# EAGLE design fountainPCB_v3 (EAGLE 9.6.2)

## Sheet 1 of 2
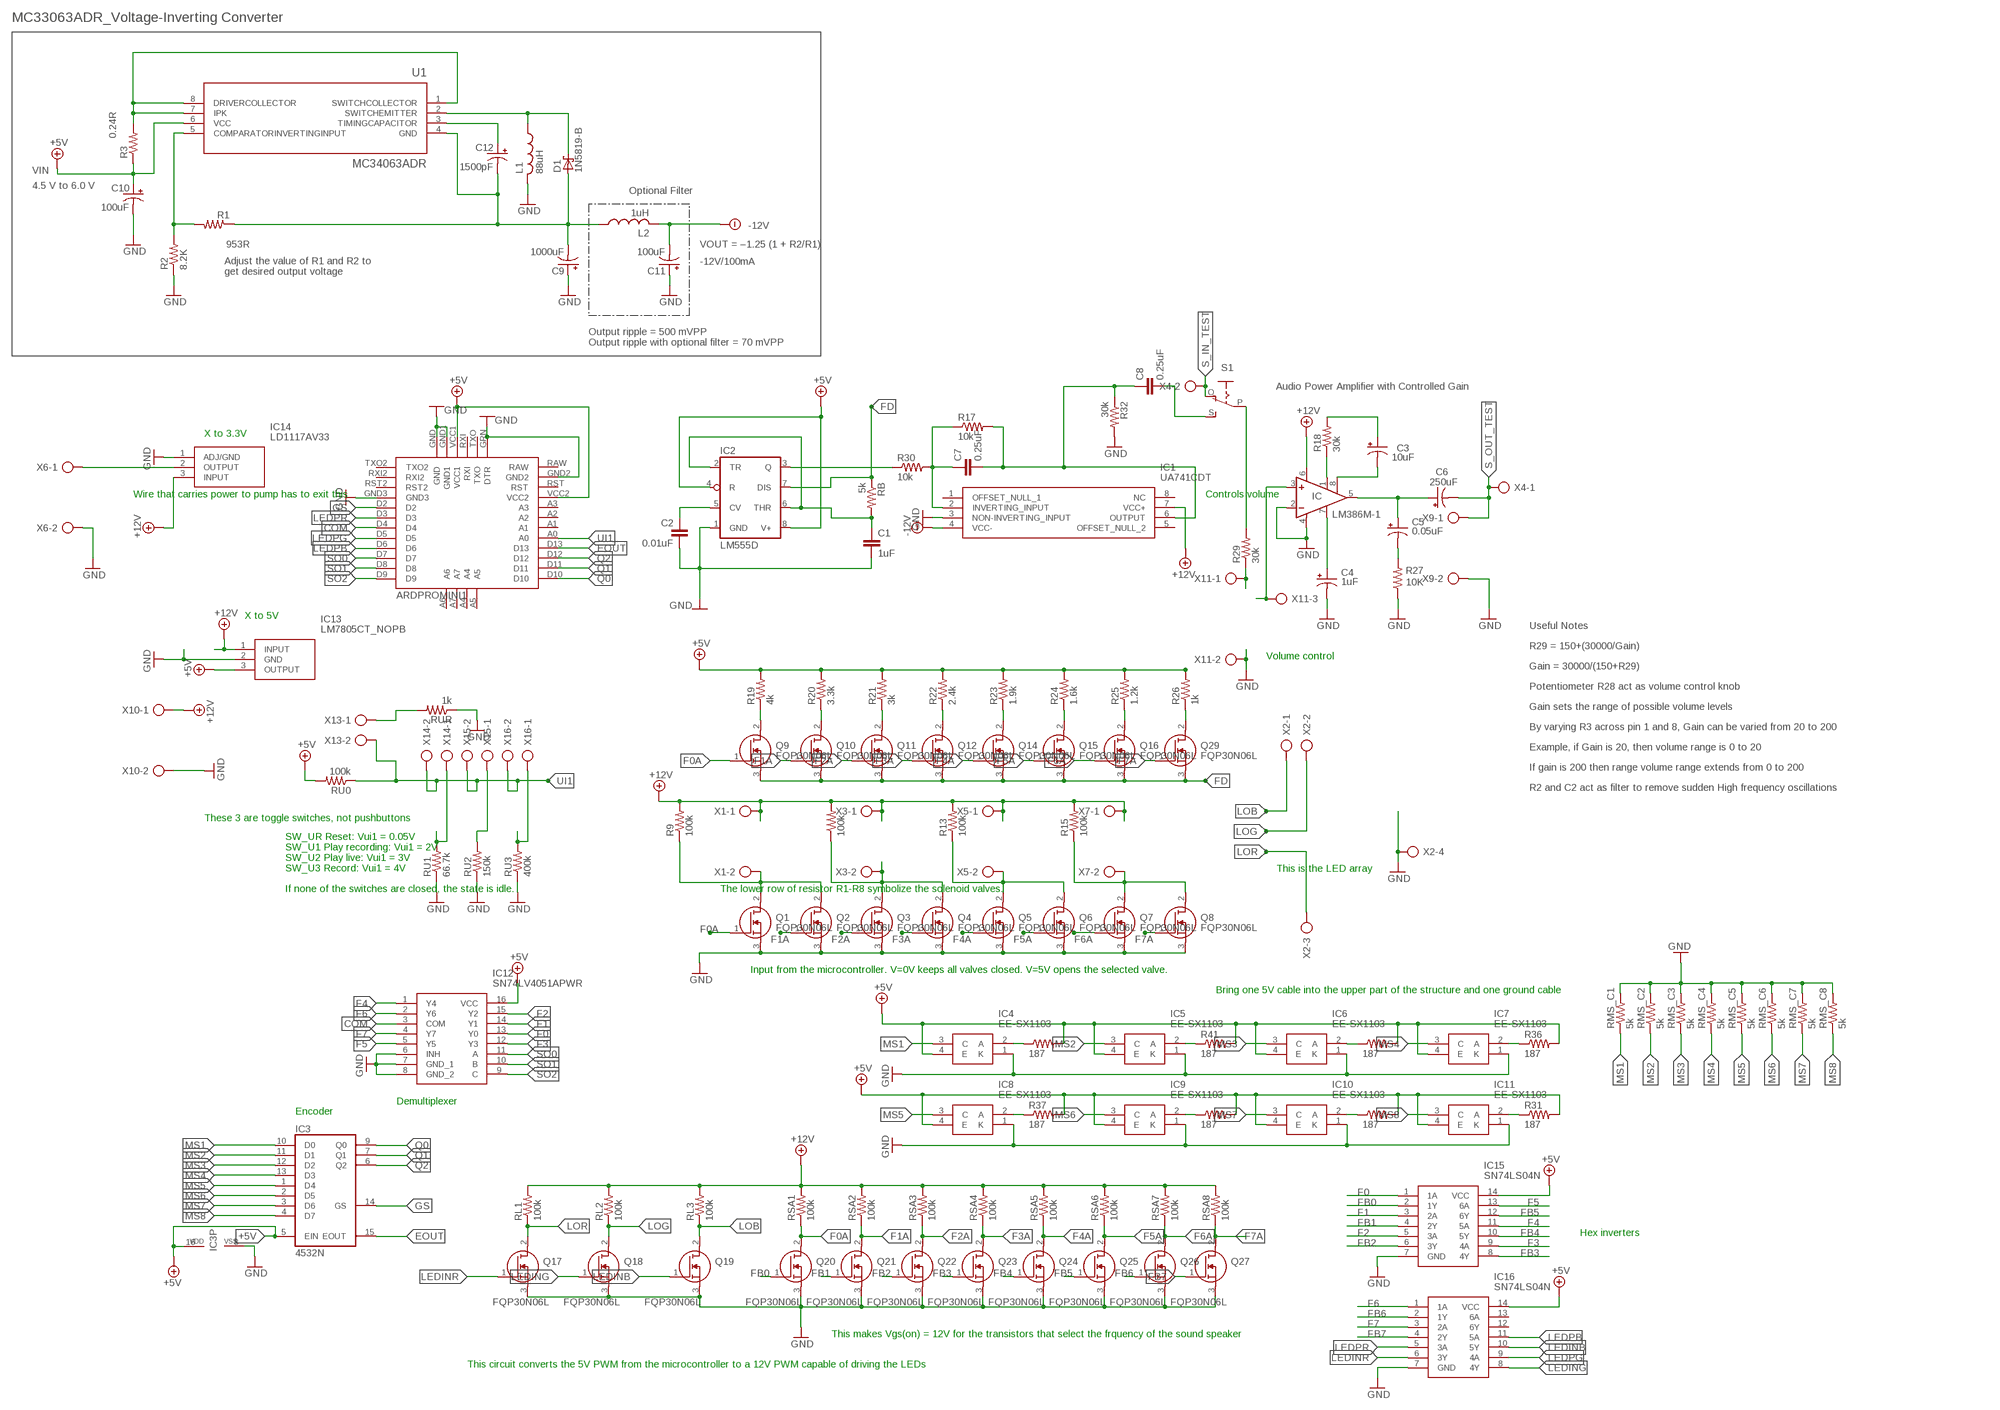
[diagram p0: schematic, sheet 1]

### Parts
ARDPROMINI1  ARDUINOPROMINI  [ARDUINOPROMINI]
C1  1uF  C-EUC0805  [C0805]
C2  0.01uF  C-EUC0805  [C0805]
C3  10uF  CPOL-US085CS-1AR  [085CS_1AR]
C4  1uF  CPOL-US085CS-1AR  [085CS_1AR]
C5  0.05uF  CPOL-US085CS-1AR  [085CS_1AR]
C6  250uF  CPOL-US085CS-1AR  [085CS_1AR]
C7  0.25uF  C-EUC0805  [C0805]
C8  0.25uF  C-EUC0805  [C0805]
C9  1000uF  CPOL-USE7.5-16  [E7,5-16]
C10  100uF  CPOL-USE2,5-6E  [E2,5-6E]
C11  100uF  CPOL-USE2,5-6E  [E2,5-6E]
C12  1500pF  CPOL-USE2,5-6E  [E2,5-6E]
D1  1N5819-B  [DO41-7.6]
IC  LM386M-1  [SO08]
IC1  UA741CDT  [SOIC127P600X175-8N]
IC2  LM555D  [SO08]
IC3  4532N  [DIL16]
IC4  EE-SX1103  [EESX1103]
IC5  EE-SX1103  [EESX1103]
IC6  EE-SX1103  [EESX1103]
IC7  EE-SX1103  [EESX1103]
IC8  EE-SX1103  [EESX1103]
IC9  EE-SX1103  [EESX1103]
IC10  EE-SX1103  [EESX1103]
IC11  EE-SX1103  [EESX1103]
IC12  SN74LV4051APWR  [SOP65P640X120-16N]
IC13  LM7805CT_NOPB  [TO254P470X1028X1955-3P]
IC14  LD1117AV33  [TO255P460X1020X2008-3P]
IC15  SN74LS04N  [DIP794W53P254L1930H508Q14N]
IC16  SN74LS04N  [DIP794W53P254L1930H508Q14N]
L1  88uH  L-USL3216C  [L3216C]
L2  1uH  L-USL3216C  [L3216C]
Q1  FQP30N06L  [TO254P470X1016X2019-3P]
Q2  FQP30N06L  [TO254P470X1016X2019-3P]
Q3  FQP30N06L  [TO254P470X1016X2019-3P]
Q4  FQP30N06L  [TO254P470X1016X2019-3P]
Q5  FQP30N06L  [TO254P470X1016X2019-3P]
Q6  FQP30N06L  [TO254P470X1016X2019-3P]
Q7  FQP30N06L  [TO254P470X1016X2019-3P]
Q8  FQP30N06L  [TO254P470X1016X2019-3P]
Q9  FQP30N06L  [TO254P470X1016X2019-3P]
Q10  FQP30N06L  [TO254P470X1016X2019-3P]
Q11  FQP30N06L  [TO254P470X1016X2019-3P]
Q12  FQP30N06L  [TO254P470X1016X2019-3P]
Q14  FQP30N06L  [TO254P470X1016X2019-3P]
Q15  FQP30N06L  [TO254P470X1016X2019-3P]
Q16  FQP30N06L  [TO254P470X1016X2019-3P]
Q17  FQP30N06L  [TO254P470X1016X2019-3P]
Q18  FQP30N06L  [TO254P470X1016X2019-3P]
Q19  FQP30N06L  [TO254P470X1016X2019-3P]
Q20  FQP30N06L  [TO254P470X1016X2019-3P]
Q21  FQP30N06L  [TO254P470X1016X2019-3P]
Q22  FQP30N06L  [TO254P470X1016X2019-3P]
Q23  FQP30N06L  [TO254P470X1016X2019-3P]
Q24  FQP30N06L  [TO254P470X1016X2019-3P]
Q25  FQP30N06L  [TO254P470X1016X2019-3P]
Q26  FQP30N06L  [TO254P470X1016X2019-3P]
Q27  FQP30N06L  [TO254P470X1016X2019-3P]
Q29  FQP30N06L  [TO254P470X1016X2019-3P]
R1  953R  R-US_M0805  [M0805]
R2  8.2K  R-US_M0805  [M0805]
R3  0.24R  R-US_M0805  [M0805]
R9  100k  R-US_R0805  [R0805]
R11  100k  R-US_R0805  [R0805]
R13  100k  R-US_R0805  [R0805]
R15  100k  R-US_R0805  [R0805]
R17  10k  R-US_R0805  [R0805]
R18  30k  R-US_R0805  [R0805]
R19  4k  R-US_R0805  [R0805]
R20  3.3k  R-US_R0805  [R0805]
R21  3k  R-US_R0805  [R0805]
R22  2.4k  R-US_R0805  [R0805]
R23  1.9k  R-US_R0805  [R0805]
R24  1.6k  R-US_R0805  [R0805]
R25  1.2k  R-US_R0805  [R0805]
R26  1k  R-US_R0805  [R0805]
R27  10K  R-US_M0805  [M0805]
R29  30k  R-US_R0805  [R0805]
R30  10k  R-US_R0805  [R0805]
R31  187  R-US_R0805  [R0805]
R32  30k  R-US_R0805  [R0805]
R34  187  R-US_R0805  [R0805]
R36  187  R-US_R0805  [R0805]
R37  187  R-US_R0805  [R0805]
R40  187  R-US_R0805  [R0805]
R41  187  R-US_R0805  [R0805]
R42  187  R-US_R0805  [R0805]
R44  187  R-US_R0805  [R0805]
RB  5k  R-US_R0805  [R0805]
RL1  100k  R-US_R0805  [R0805]
RL2  100k  R-US_R0805  [R0805]
RL3  100k  R-US_R0805  [R0805]
RMS_C1  5k  R-US_R0805  [R0805]
RMS_C2  5k  R-US_R0805  [R0805]
RMS_C3  5k  R-US_R0805  [R0805]
RMS_C4  5k  R-US_R0805  [R0805]
RMS_C5  5k  R-US_R0805  [R0805]
RMS_C6  5k  R-US_R0805  [R0805]
RMS_C7  5k  R-US_R0805  [R0805]
RMS_C8  5k  R-US_R0805  [R0805]
RSA1  100k  R-US_R0805  [R0805]
RSA2  100k  R-US_R0805  [R0805]
RSA3  100k  R-US_R0805  [R0805]
RSA4  100k  R-US_R0805  [R0805]
RSA5  100k  R-US_R0805  [R0805]
RSA6  100k  R-US_R0805  [R0805]
RSA7  100k  R-US_R0805  [R0805]
RSA8  100k  R-US_R0805  [R0805]
RU0  100k  R-US_R0805  [R0805]
RU1  66.7k  R-US_R0805  [R0805]
RU2  150k  R-US_R0805  [R0805]
RU3  400k  R-US_R0805  [R0805]
RUR  1k  R-US_R0805  [R0805]
S1  EG1218S  [EG1218]
U1  MC34063ADR  [D8]
X1  AK300/2  [AK300/2]
X2  AK300/4  [AK300/4]
X3  AK300/2  [AK300/2]
X4  AK300/2  [AK300/2]
X5  AK300/2  [AK300/2]
X6  AK300/2  [AK300/2]
X7  AK300/2  [AK300/2]
X9  AK300/2  [AK300/2]
X10  AK300/2  [AK300/2]
X11  AK300/3  [AK300/3]
X13  AK300/2  [AK300/2]
X14  AK300/2  [AK300/2]
X15  AK300/2  [AK300/2]
X16  AK300/2  [AK300/2]

### Nets
+5V: ARDPROMINI1.VCC1 ARDPROMINI1.VCC2 C10.+ IC2.4(R) IC2.8(V+) IC3.5(EIN) IC3.16(VDD) IC4.4(E) IC5.4(E) IC6.4(E) IC7.4(E) IC8.4(E) IC9.4(E) IC10.4(E) IC11.4(E) IC12.16(VCC) IC13.3(OUTPUT) IC15.14(VCC) IC16.14(VCC) R3.1 R19.2 R20.2 R21.2 R22.2 R23.2 R24.2 R25.2 R26.2 R31.2 R34.2 R36.2 R37.2 R40.2 R41.2 R42.2 R44.2 RU0.2 U1.6(VCC)
+12V: IC1.7(VCC+) IC13.1(INPUT) IC14.3(INPUT) IC.6(VS) R9.2 R11.2 R13.2 R15.2 RL1.2 RL2.2 RL3.2 RSA1.2 RSA2.2 RSA3.2 RSA4.2 RSA5.2 RSA6.2 RSA7.2 RSA8.2 X1.1 X3.1 X5.1 X7.1 X10.1
+12V1: IC14.2(OUTPUT) X6.1
-12V: C11.- IC1.4(VCC-) L2.2
COM: ARDPROMINI1.D4 IC12.3(COM)
EOUT: ARDPROMINI1.D13 IC3.15(EOUT)
F0: IC12.13(Y0) IC15.1(1A)
F0A: Q1.1(G) Q9.1(G) Q20.2(D) RSA1.1
F1: IC12.14(Y1) IC15.3(2A)
F1A: Q2.1(G) Q10.1(G) Q21.2(D) RSA2.1
F2: IC12.15(Y2) IC15.5(3A)
F2A: Q3.1(G) Q11.1(G) Q22.2(D) RSA3.1
F3: IC12.12(Y3) IC15.9(4A)
F3A: Q4.1(G) Q12.1(G) Q23.2(D) RSA4.1
F4: IC12.1(Y4) IC15.11(5A)
F4A: Q5.1(G) Q14.1(G) Q24.2(D) RSA5.1
F5: IC12.5(Y5) IC15.13(6A)
F5A: Q6.1(G) Q15.1(G) Q25.2(D) RSA6.1
F6: IC12.2(Y6) IC16.1(1A)
F6A: Q7.1(G) Q16.1(G) Q26.2(D) RSA7.1
F7: IC12.4(Y7) IC16.3(2A)
F7A: Q8.1(G) Q27.2(D) Q29.1(G) RSA8.1
FB0: IC15.2(1Y) Q20.1(G)
FB1: IC15.4(2Y) Q21.1(G)
FB2: IC15.6(3Y) Q22.1(G)
FB3: IC15.8(4Y) Q23.1(G)
FB4: IC15.10(5Y) Q24.1(G)
FB5: IC15.12(6Y) Q25.1(G)
FB6: IC16.2(1Y) Q26.1(G)
FB7: IC16.4(2Y) Q27.1(G)
FD: IC2.7(DIS) Q9.3(S) Q10.3(S) Q11.3(S) Q12.3(S) Q14.3(S) Q15.3(S) Q16.3(S) Q29.3(S) RB.1
GND: ARDPROMINI1.GND ARDPROMINI1.GND1 ARDPROMINI1.GND2 ARDPROMINI1.GND3 ARDPROMINI1.GRN(DTR) C1.2 C2.2 C4.- C9.+ C10.- C11.+ IC1.3(NON-INVERTING_INPUT) IC2.1(GND) IC3.8(VSS) IC4.1(K) IC5.1(K) IC6.1(K) IC7.1(K) IC8.1(K) IC9.1(K) IC10.1(K) IC11.1(K) IC12.6(INH) IC12.7(GND_1) IC12.8(GND_2) IC13.2(GND) IC14.1(ADJ/GND) IC15.7(GND) IC16.7(GND) IC.2(-IN) IC.4(GND) L1.2 Q1.3(S) Q2.3(S) Q3.3(S) Q4.3(S) Q5.3(S) Q6.3(S) Q7.3(S) Q8.3(S) Q17.3(S) Q18.3(S) Q19.3(S) Q20.3(S) Q21.3(S) Q22.3(S) Q23.3(S) Q24.3(S) Q25.3(S) Q26.3(S) Q27.3(S) R2.1 R27.1 R32.2 RMS_C1.2 RMS_C2.2 RMS_C3.2 RMS_C4.2 RMS_C5.2 RMS_C6.2 RMS_C7.2 RMS_C8.2 RU1.1 RU2.1 RU3.1 RUR.1 X2.4 X6.2 X9.2 X10.2 X11.2
GS: ARDPROMINI1.D2 IC3.14(GS)
LEDINB: IC16.10(5Y) Q19.1(G)
LEDING: IC16.8(4Y) Q18.1(G)
LEDINR: IC16.6(3Y) Q17.1(G)
LEDPB: ARDPROMINI1.D6 IC16.11(5A)
LEDPG: ARDPROMINI1.D5 IC16.9(4A)
LEDPR: ARDPROMINI1.D3 IC16.5(3A)
LOB: Q19.2(D) RL3.1 X2.1
LOG: Q18.2(D) RL2.1 X2.2
LOR: Q17.2(D) RL1.1 X2.3
MS1: IC3.10(D0) IC4.3(C) RMS_C1.1
MS2: IC3.11(D1) IC5.3(C) RMS_C2.1
MS3: IC3.12(D2) IC6.3(C) RMS_C3.1
MS4: IC3.13(D3) IC7.3(C) RMS_C4.1
MS5: IC3.1(D4) IC8.3(C) RMS_C5.1
MS6: IC3.2(D5) IC9.3(C) RMS_C6.1
MS7: IC3.3(D6) IC10.3(C) RMS_C7.1
MS8: IC3.4(D7) IC11.3(C) RMS_C8.1
N$1: Q1.2(D) Q2.2(D) R9.1 X1.2
N$3: Q3.2(D) Q4.2(D) R11.1 X3.2
N$4: R3.2 U1.1(SWITCHCOLLECTOR) U1.7(IPK) U1.8(DRIVERCOLLECTOR)
N$5: Q5.2(D) Q6.2(D) R13.1 X5.2
N$6: D1.C L1.1 U1.2(SWITCHEMITTER)
N$7: Q7.2(D) Q8.2(D) R15.1 X7.2
N$8: C12.+ U1.3(TIMINGCAPACITOR)
N$9: C2.1 IC2.5(CV)
N$10: IC4.2(A) R44.1
N$11: C1.1 IC2.2(TR) IC2.6(THR) RB.2
N$12: Q9.2(D) R19.1
N$13: Q10.2(D) R20.1
N$14: Q11.2(D) R21.1
N$15: Q12.2(D) R22.1
N$16: Q14.2(D) R23.1
N$17: Q15.2(D) R24.1
N$18: Q16.2(D) R25.1
N$19: Q29.2(D) R26.1
N$20: C4.+ IC.7(BYPASS)
N$21: C5.+ C6.+ IC.5(OUT)
N$22: C3.- IC.8(GAIN)
N$23: IC.3(+IN) X11.3
N$24: C5.- R27.2
N$25: IC.1(GAIN) R18.1
N$26: C3.+ R18.2
N$27: R29.2 S1.P
N$28: C7.1 IC1.2(INVERTING_INPUT) R17.1 R30.2
N$29: C7.2 C8.1 IC1.6(OUTPUT) R17.2 R32.1
N$30: RUR.2 X13.1
N$31: IC8.2(A) R37.1
N$32: IC5.2(A) R41.1
N$33: RU3.2 X16.1
N$34: RU2.2 X15.1
N$35: RU1.2 X14.1
N$36: IC6.2(A) R42.1
N$37: IC7.2(A) R36.1
N$38: R1.2 R2.2 U1.5(COMPARATORINVERTINGINPUT)
N$39: IC11.2(A) R31.1
N$40: IC10.2(A) R40.1
N$41: IC9.2(A) R34.1
N$42: C9.- C12.- D1.A L2.1 R1.1 U1.4(GND)
N$43: R29.1 X11.1
N$44: C8.2 S1.S
N$45: IC2.3(Q) R30.1
Q0: ARDPROMINI1.D10 IC3.9(Q0)
Q1: ARDPROMINI1.D11 IC3.7(Q1)
Q2: ARDPROMINI1.D12 IC3.6(Q2)
S_IN_TEST: S1.O X4.2
S_OUT_TEST: C6.- X4.1 X9.1
SO0: ARDPROMINI1.D7 IC12.11(A)
SO1: ARDPROMINI1.D8 IC12.10(B)
SO2: ARDPROMINI1.D9 IC12.9(C)
UI1: ARDPROMINI1.A0 RU0.1 X13.2 X14.2 X15.2 X16.2
Unconnected: ARDPROMINI1.A1 ARDPROMINI1.A2 ARDPROMINI1.A3 ARDPROMINI1.A4 ARDPROMINI1.A5 ARDPROMINI1.A6 ARDPROMINI1.A7 ARDPROMINI1.RAW ARDPROMINI1.RST ARDPROMINI1.RST2 ARDPROMINI1.RXI ARDPROMINI1.RXI2 ARDPROMINI1.TXO ARDPROMINI1.TXO2 IC1.1(OFFSET_NULL_1) IC1.5(OFFSET_NULL_2) IC1.8(NC) IC16.12(6Y) IC16.13(6A)

### Notes on the sheet
- MC33063ADR_Voltage-Inverting Converter
- VIN
- 4.5 V to 6.0 V
- Optional Filter
- VOUT = –1.25 (1 + R2/R1)
- -12V/100mA
- Adjust the value of R1 and R2 to
  get desired output voltage
- Output ripple = 500 mVPP
  Output ripple with optional filter = 70 mVPP
- Audio Power Amplifier with Controlled Gain
- X to 3.3V
- Wire that carries power to pump has to exit this | Controls volume
- X to 5V
- Useful Notes
- R29 = 150+(30000/Gain)
- Volume control
- Gain = 30000/(150+R29)
- Potentiometer R28 act as volume control knob
- Gain sets the range of possible volume levels
- By varying R3 across pin 1 and 8, Gain can be varied from 20 to 200
- Example, if Gain is 20, then volume range is 0 to 20
- If gain is 200 then range volume range extends from 0 to 200
- R2 and C2 act as filter to remove sudden High frequency oscillations
- These 3 are toggle switches, not pushbuttons
- SW_UR Reset: Vui1 = 0.05V
  SW_U1 Play recording: Vui1 = 2V
  SW_U2 Play live: Vui1 = 3V
  SW_U3 Record: Vui1 = 4V
- This is the LED array
- If none of the switches are closed, the state is idle. | The lower row of resistor R1-R8 symbolize the solenoid valves.
- Input from the microcontroller. V=0V keeps all valves closed. V=5V opens the selected valve.
- Bring one 5V cable into the upper part of the structure and one ground cable
- Demultiplexer
- Encoder
- Hex inverters
- This makes Vgs(on) = 12V for the transistors that select the frquency of the sound speaker
- This circuit converts the 5V PWM from the microcontroller to a 12V PWM capable of driving the LEDs

## Sheet 2 of 2

## Library data of the parts
ARDPROMINI1 = ARDPROMINI:ARDUINOPROMINI
C1 C2 = rcl:C-EU: CAPACITOR, European symbol
C3-C6 = resistor:CPOL-US: POLARIZED CAPACITOR, American symbol; SPICEPREFIX: C
C7 C8 = rcl:C-EU: CAPACITOR, European symbol; SPICEPREFIX: C
C9-C12 = rcl:CPOL-US: POLARIZED CAPACITOR, American symbol
D1 = diode:1N581*: 1.0A SCHOTTKY BARRIER RECTIFIER Source: http://www.diodes.com/datasheets/ds23001.pdf
IC = linear:LM386?-*: Low Voltage Audio Power Amplifier Source: http://cache.national.com/ds/LM/LM386.pdf; SPICEPREFIX: X
IC1 = SamacSys_Parts:UA741CDT: UA741CDT, Operational Amplifier 1MHz, 8-Pin SO Source: Datasheet <http://www.st.com/st-web-ui/static/active/en/resource/technical/document/datasheet/CD00001252.pdf>; DESCRIPTION: UA741CDT, Operational Amplifier 1MHz, 8-Pin SO; HEIGHT: 1.75mm; MANUFACTURER_NAME: STMicroelectronics; MANUFACTURER_PART_NUMBER: UA741CDT; MOUSER_PART_NUMBER: 511-UA741CDT; MOUSER_PRICE-STOCK: https://www.mouser.co.uk/ProductDetail/STMicroelectronics/UA741CDT?qs=%2FlukYmqnbBNY05lTc81SqA%3D%3D; SPICEPREFIX: X
IC2 = linear:*555: TIMER; SPICEPREFIX: X
IC3 = 45xx:4532: 8-bit PRIORITY ENCODER; SPICEPREFIX: X
IC4-IC11 = SamacSys_Parts:EE-SX1103: Omron Photoelectric Sensor Diffuse Source: Datasheet <https://omronfs.omron.com/en_US/ecb/products/pdf/en-ee_sx1103.pdf>; DESCRIPTION: Omron Photoelectric Sensor Diffuse; HEIGHT: 5.2mm; MANUFACTURER_NAME: Omron Electronics; MANUFACTURER_PART_NUMBER: EE-SX1103; MOUSER_PART_NUMBER: 653-EE-SX1103; MOUSER_PRICE-STOCK: https://www.mouser.co.uk/ProductDetail/Omron-Electronics/EE-SX1103?qs=Pjd0UV7BHP9I6UcF70KjMA%3D%3D
IC12 = SamacSys_Parts:SN74LV4051APWR: 8-Channel Analog Multiplexer/Demultiplexer Source: Datasheet <http://www.ti.com/lit/gpn/sn74lv4051a>; DESCRIPTION: 8-Channel Analog Multiplexer/Demultiplexer; HEIGHT: 1.2mm; MANUFACTURER_NAME: Texas Instruments; MANUFACTURER_PART_NUMBER: SN74LV4051APWR; MOUSER_PART_NUMBER: 595-SN74LV4051APWR; MOUSER_PRICE-STOCK: https://www.mouser.co.uk/ProductDetail/Texas-Instruments/SN74LV4051APWR?qs=j%2FZo4ajzVJI89x2tgWsgsA%3D%3D; SPICEPREFIX: X
IC13 = SamacSys_Parts:LM7805CT_NOPB: 1.5-A, Wide VIN Fixed Voltage Regulators Source: Datasheet <http://www.ti.com/lit/gpn/lm7800>; DESCRIPTION: 1.5-A, Wide VIN Fixed Voltage Regulators; HEIGHT: 4.7mm; MANUFACTURER_NAME: Texas Instruments; MANUFACTURER_PART_NUMBER: LM7805CT/NOPB; MOUSER_PART_NUMBER: 926-LM7805CT/NOPB; MOUSER_PRICE-STOCK: https://www.mouser.co.uk/ProductDetail/Texas-Instruments/LM7805CT-NOPB?qs=OYMYEaN9QmBS2GvaX6GSkQ%3D%3D
IC14 = SamacSys_Parts:LD1117AV33: LD1117AV33, Low Dropout Voltage Regulator, 1.2A, 3.3 V +/-2%, 3-Pin TO-220 Source: Datasheet <http://www.st.com/web/en/resource/technical/document/datasheet/CD00002116.pdf>; DESCRIPTION: LD1117AV33, Low Dropout Voltage Regulator, 1.2A, 3.3 V +/-2%, 3-Pin TO-220; HEIGHT: 4.6mm; MANUFACTURER_NAME: STMicroelectronics; MANUFACTURER_PART_NUMBER: LD1117AV33; MOUSER_PART_NUMBER: 511-LD1117AV33; MOUSER_PRICE-STOCK: https://www.mouser.co.uk/ProductDetail/STMicroelectronics/LD1117AV33?qs=hUhhBvpTJN9Rfx8G8TXH1A%3D%3D
IC15 IC16 = SamacSys_Parts:SN74LS04N: Hex inverter,SN74LS04N DIP14 25pcs Source: Datasheet <http://www.ti.com/lit/gpn/sn74ls04>; DESCRIPTION: Hex inverter,SN74LS04N DIP14 25pcs; HEIGHT: 5.08mm; MANUFACTURER_NAME: Texas Instruments; MANUFACTURER_PART_NUMBER: SN74LS04N; MOUSER_PART_NUMBER: 595-SN74LS04N; MOUSER_PRICE-STOCK: https://www.mouser.co.uk/ProductDetail/Texas-Instruments/SN74LS04N?qs=spW5eSrOWB4DgGWIHPxzvg%3D%3D; SPICEPREFIX: X
L1 L2 = rcl:L-US: INDUCTOR, American symbol
Q1-Q12 Q14-Q27 Q29 = SamacSys_Parts:FQP30N06L: FQP30N06L N-Channel MOSFET, 32 A, 60 V QFET, 3-Pin TO-220 ON Semiconductor Source: Datasheet; DESCRIPTION: FQP30N06L N-Channel MOSFET, 32 A, 60 V QFET, 3-Pin TO-220 ON Semiconductor; HEIGHT: 4.7mm; MANUFACTURER_NAME: ON Semiconductor; MANUFACTURER_PART_NUMBER: FQP30N06L; MOUSER_PART_NUMBER: 512-FQP30N06L; MOUSER_PRICE-STOCK: https://www.mouser.co.uk/ProductDetail/ON-Semiconductor-Fairchild/FQP30N06L?qs=%252Beu4QTTVkDqugBwFplJ%252Bug%3D%3D
R1-R3 R9 R11 R13 R15 R17-R26 R29-R32 R34 R36 R37 R40-R42 R44 RB RL1-RL3 RMS_C1-RMS_C8 RSA1-RSA8 RU0 RU1-RU3 RUR = rcl:R-US_: RESISTOR, American symbol
R27 = resistor:R-US_: RESISTOR, American symbol; SPICEPREFIX: R
S1 = adafruit:EG1218: SLIDING SWITCH 0.1" spacing through hole, vertical SPDT slide switch http://www.ladyada.net/library/pcb/eaglelibrary.html; SPICEPREFIX: J
U1 = MC34063ADR:MC34063ADR; MANUFACTURER_PART_NUMBER: MC34063ADR; VENDOR: Texas Instruments
X1 X3 X5-X7 X9 X10 X13-X16 = con-ptr500:AK300/2: CONNECTOR; OC_FARNELL: unknown; OC_NEWARK: unknown; SPICEPREFIX: X
X2 = con-ptr500:AK300/4: CONNECTOR; OC_FARNELL: unknown; OC_NEWARK: unknown
X4 = con-ptr500:AK300/2: CONNECTOR; OC_FARNELL: unknown; OC_NEWARK: unknown
X11 = con-ptr500:AK300/3: CONNECTOR; OC_FARNELL: unknown; OC_NEWARK: unknown; SPICEPREFIX: X

## Net classes
0 default: width 0.203 mm
1 vcc: width 0.254 mm

## Board
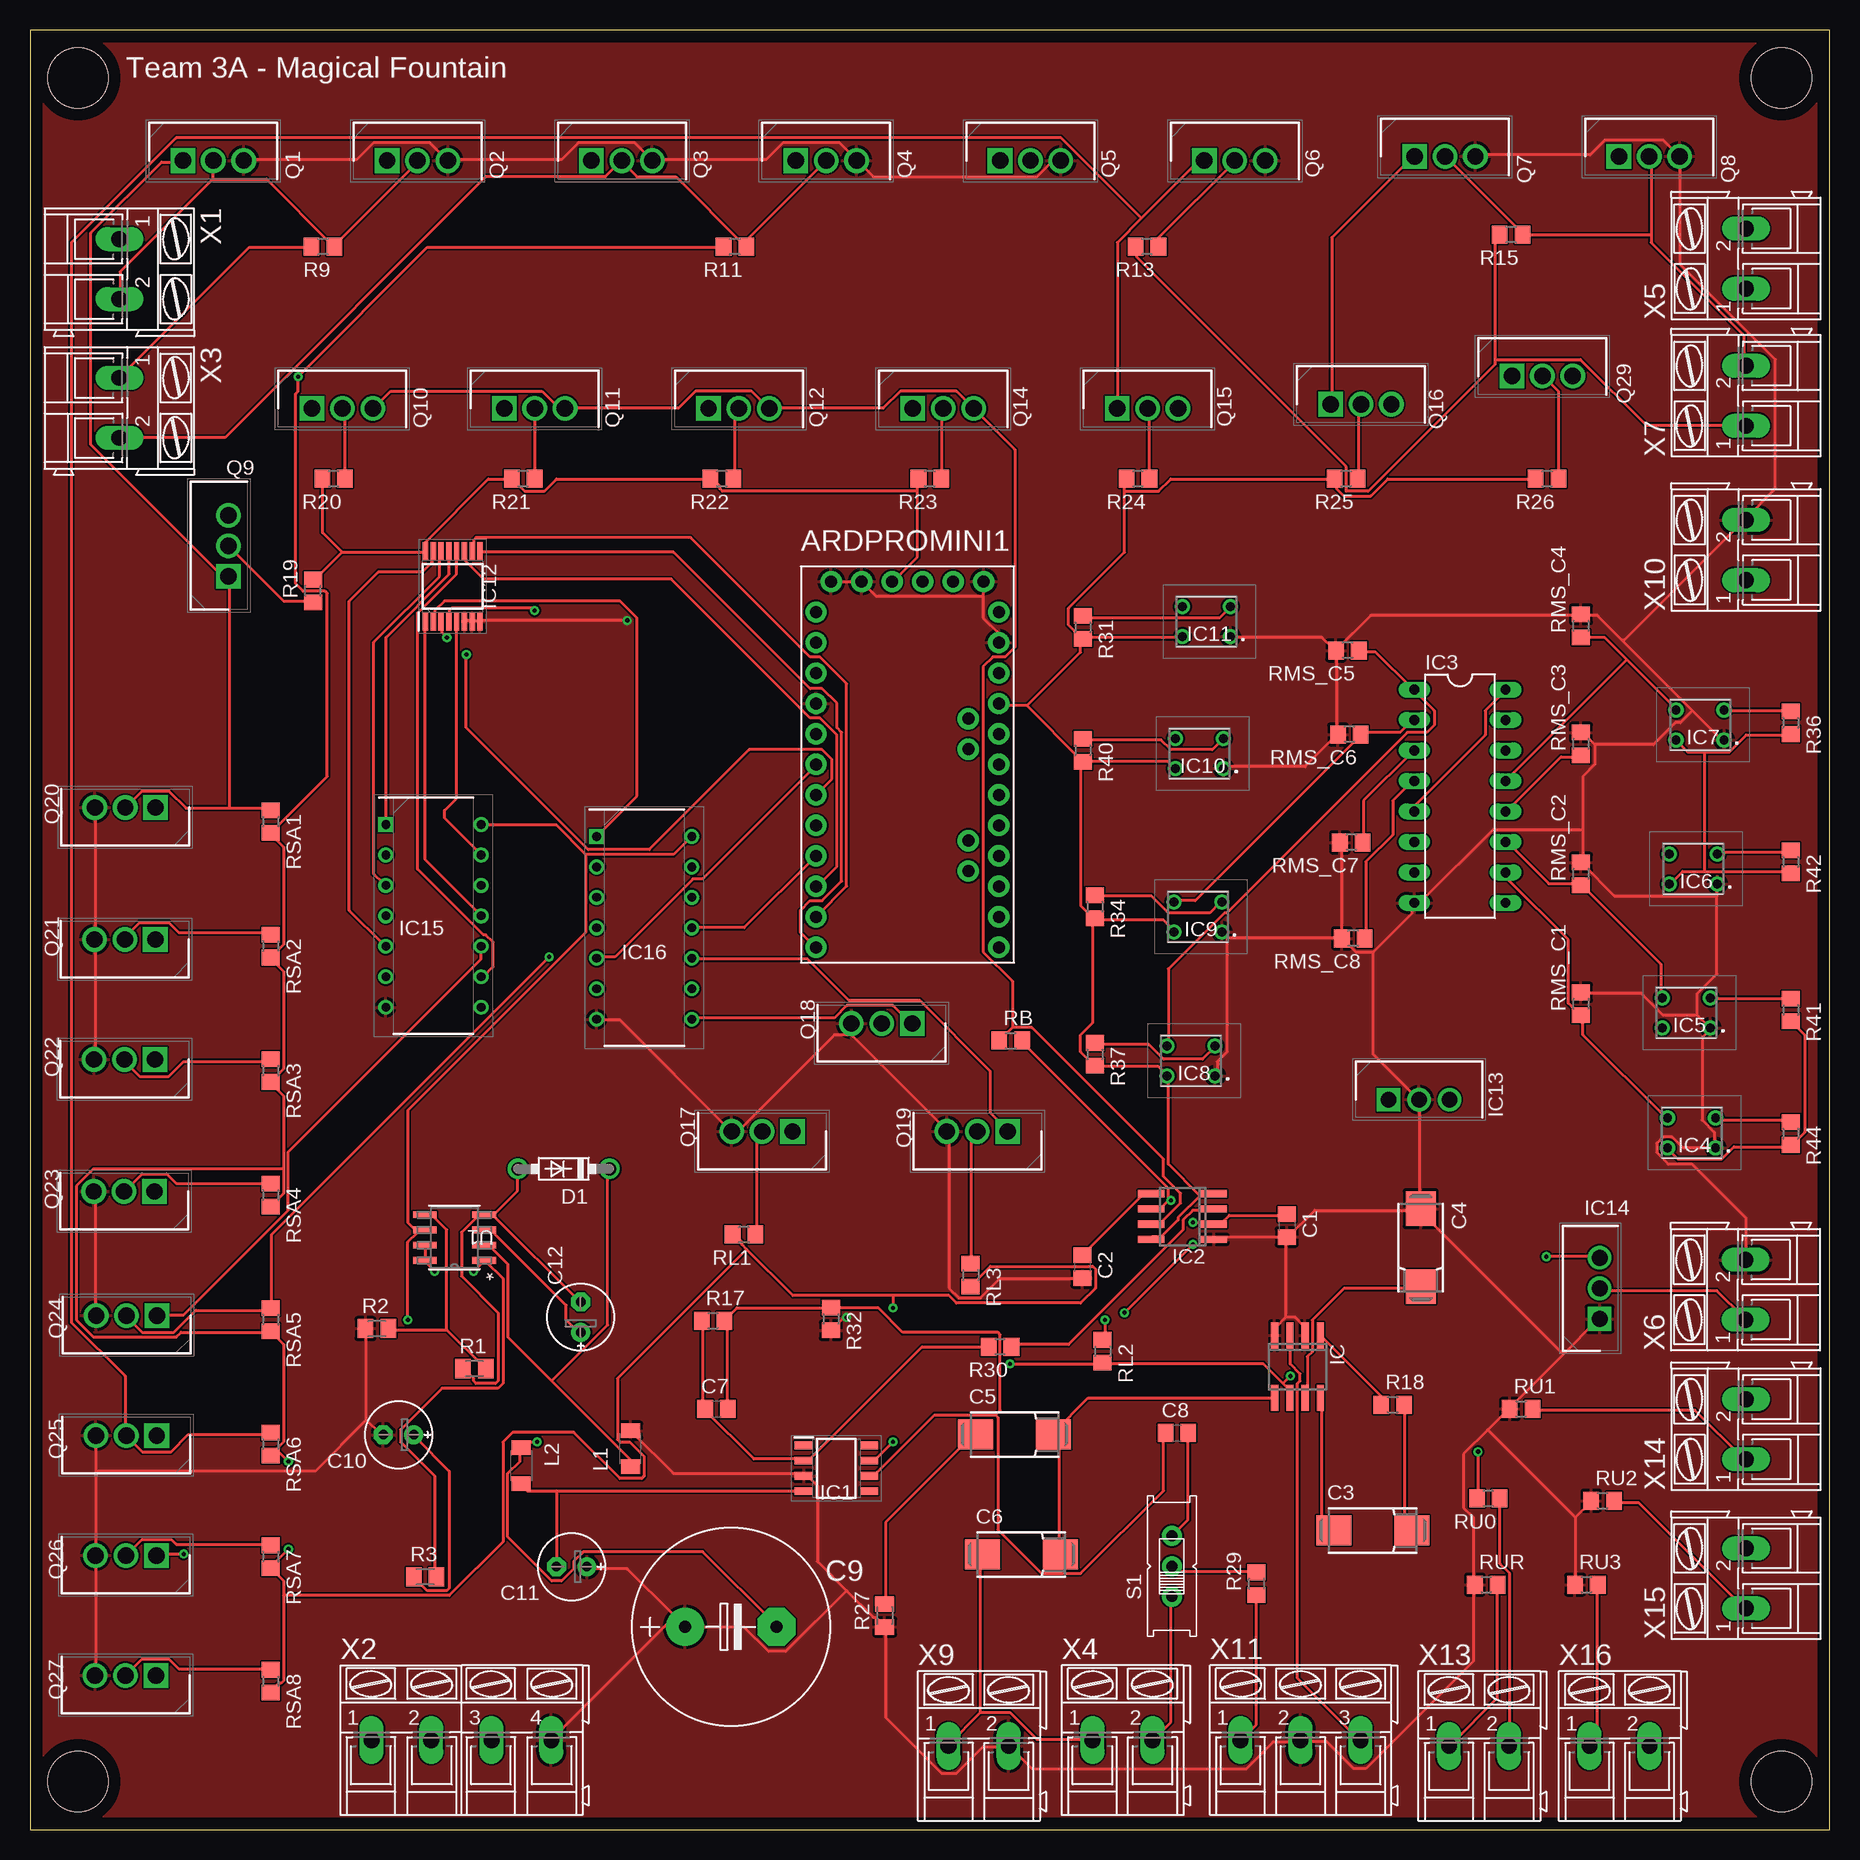
[diagram p1: board, top side]
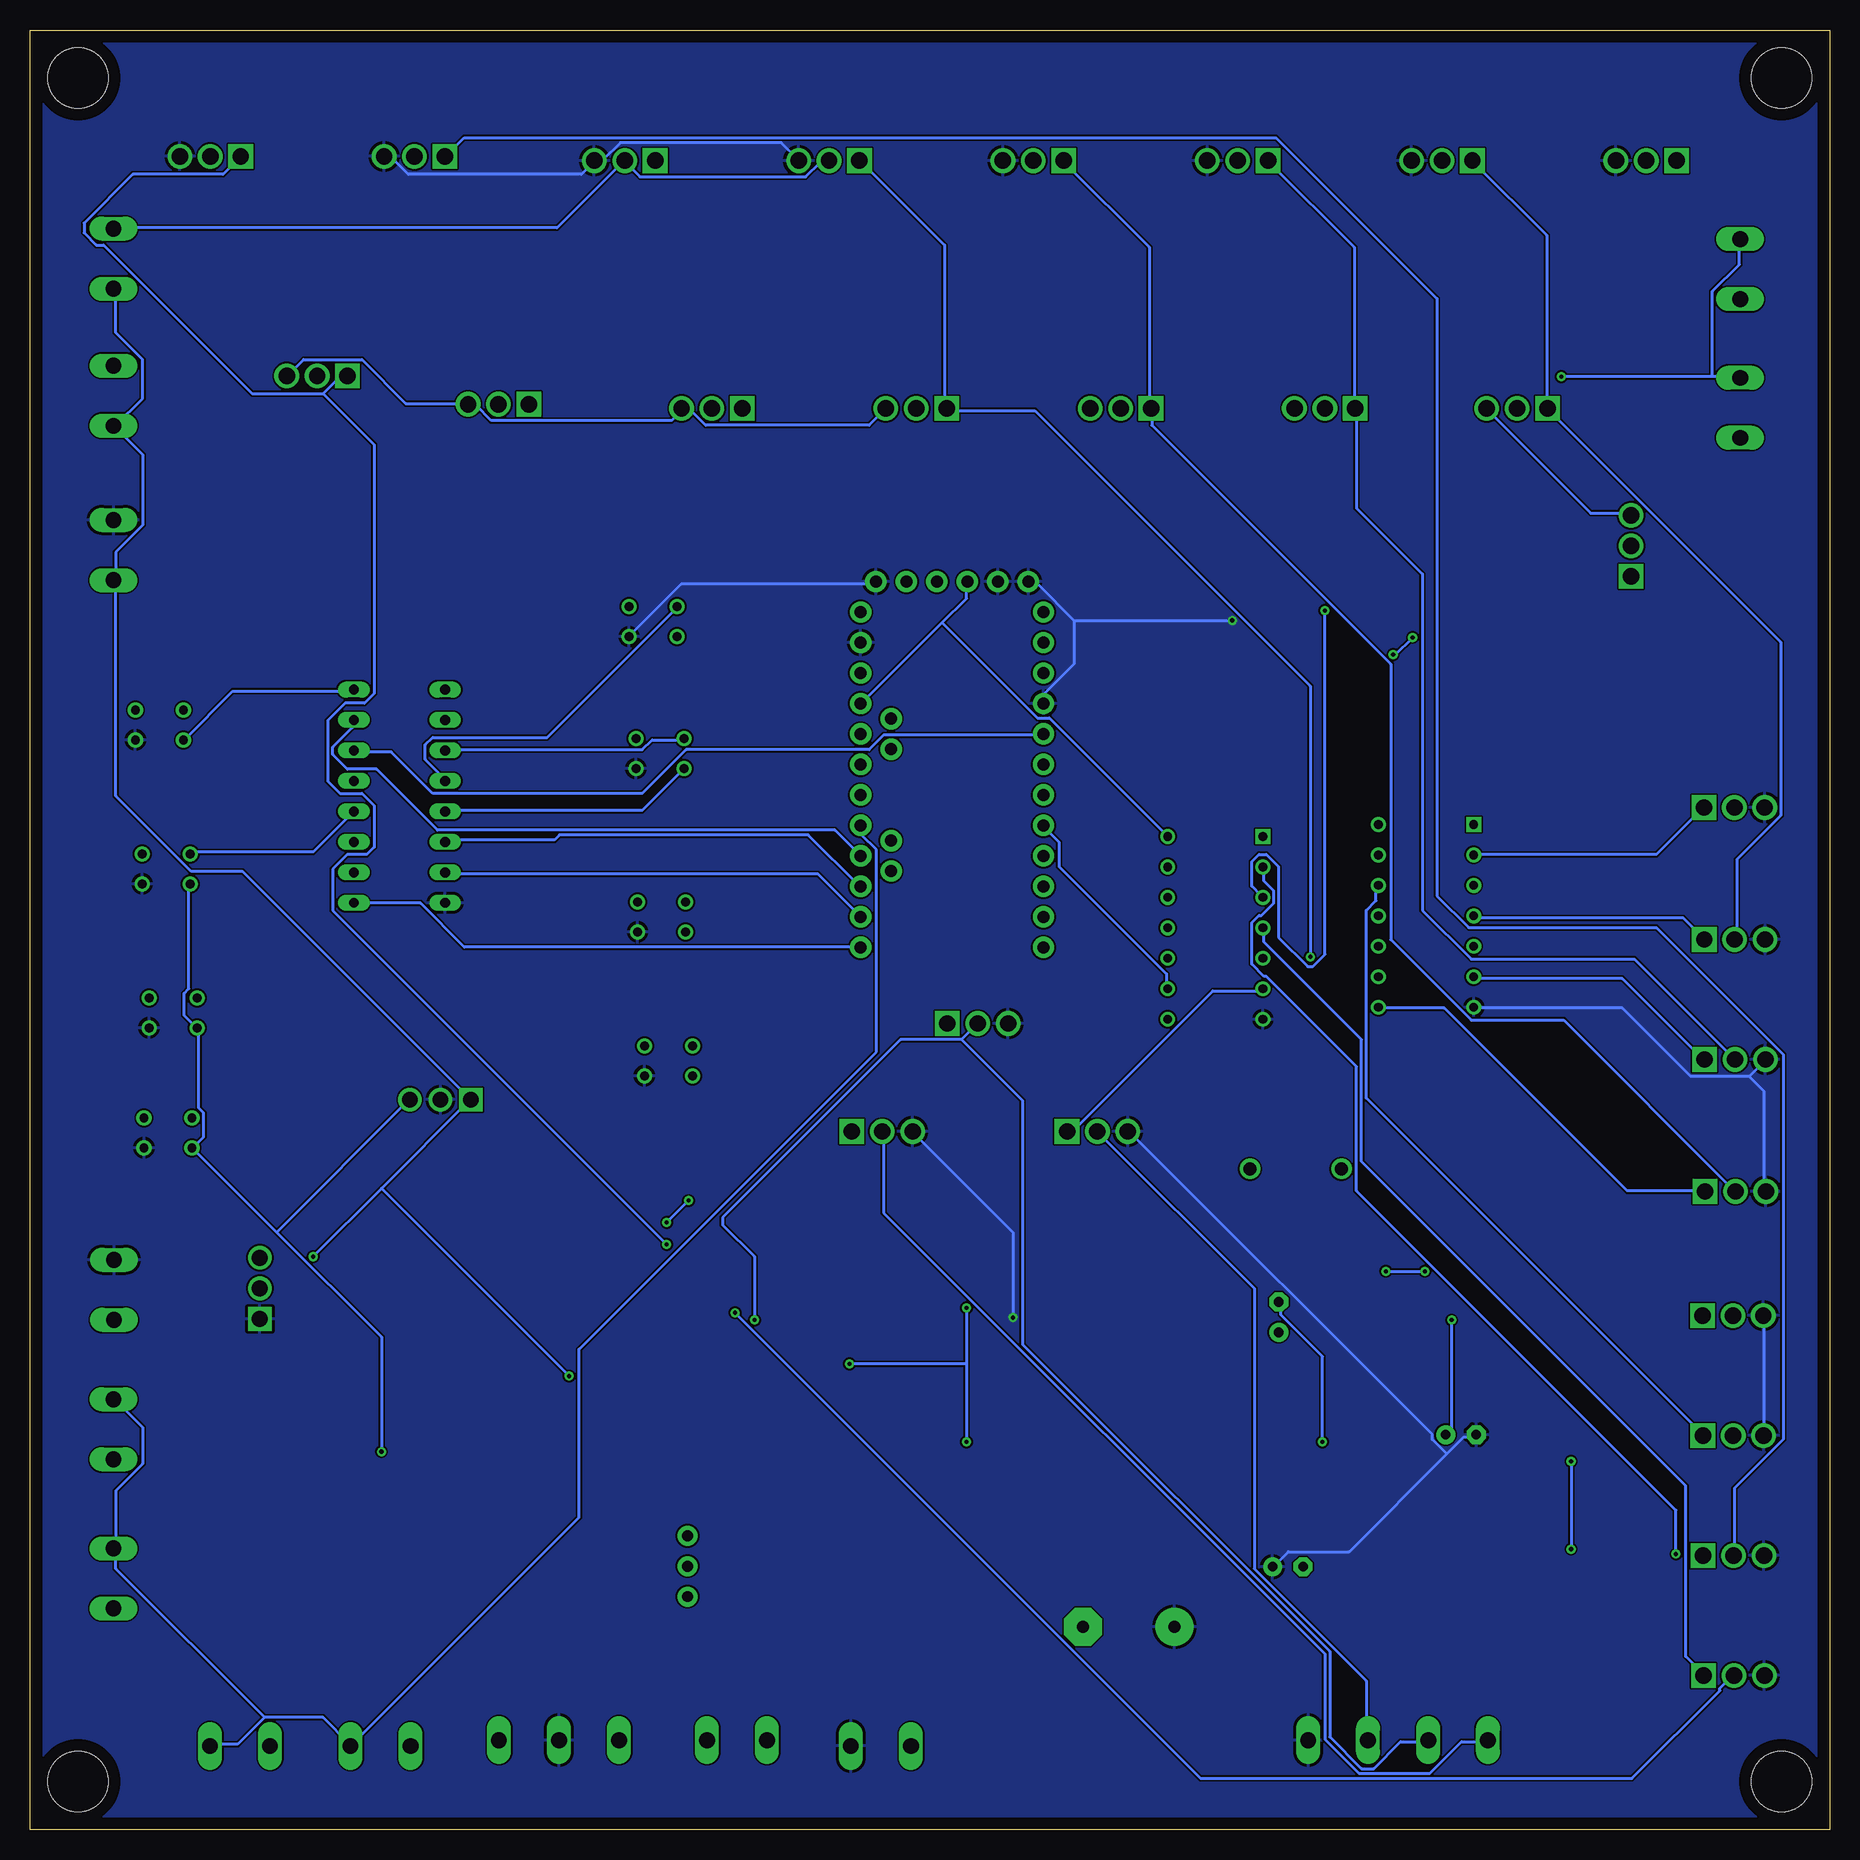
[diagram p2: board, bottom side, seen from below]

Size 150 x 150 mm. Coordinates in mm from the lower left corner, seen from the top.
Outline: 0,0 150,0 150,150 0,150 0,0
Copper layers (1*16): Top 0.036mm / dielectric 1.6mm / Bottom 0.036mm
Design rules "default": minimum track width 10mil, minimum drill 0.35mm, track to track 6mil, track to pad 6mil, pad to pad 6mil, via to via 6mil, smd to smd 6mil, copper to edge 40mil, drill to drill 6mil, minimum pad ring 10mil, minimum via ring 8mil, stop-mask expansion 4mil, vias tented up to drill 0mil, thermal gap 10mil
Holes 5 mm at 4,146 4,4 146,4 146,146

### Footprints (pad centres in the part's own frame; a part is rotated, then mirrored left to right if it is on the bottom)
ARDUINOPROMINI = drill 1 pad 1.778: A0 16.51,11.43; A1 16.51,13.97; A2 16.51,16.51; A3 16.51,19.05; A4 13.97,17.78; A5 13.97,20.32; A6 13.97,7.62; A7 13.97,10.16; D2 1.27,19.05; D3 1.27,16.51; D4 1.27,13.97; D5 1.27,11.43; D6 1.27,8.89; D7 1.27,6.35; D8 1.27,3.81; D9 1.27,1.27; D10 16.51,1.27; D11 16.51,3.81; D12 16.51,6.35; D13 16.51,8.89; GND 2.54,31.75; GND1 5.08,31.75; GND2 16.51,26.67; GND3 1.27,21.59; GRN 15.24,31.75; RAW 16.51,29.21; RST 16.51,24.13; RST2 1.27,24.13; RXI 10.16,31.75; RXI2 1.27,26.67; TXO 12.7,31.75; TXO2 1.27,29.21; VCC1 7.62,31.75; VCC2 16.51,21.59
C0805 = smd 1.3 x 1.5: 1 -0.95,0; 2 0.95,0
085CS_1AR = smd 2.9 x 2.5: + 3.25,0; - -3.25,0
E7,5-16 = drill 1.016 pad 3.15: + -3.81,0 | drill 1.016 pad 3.15 octagon: - 3.81,0
E2,5-6E = drill 0.813 pad 1.575: + -1.27,0 | drill 0.813 pad 1.575 octagon: - 1.27,0
DO41-7.6 = drill 1.1 pad 1.7: A 3.81,0; C -3.81,0
SO08 = smd 0.6 x 2.2: 1 -1.905,-2.6; 2 -0.635,-2.6; 3 0.635,-2.6; 4 1.905,-2.6; 5 1.905,2.6; 6 0.635,2.6; 7 -0.635,2.6; 8 -1.905,2.6
SOIC127P600X175-8N = smd 1.525 x 0.65: 1 -2.712,1.905; 2 -2.712,0.635; 3 -2.712,-0.635; 4 -2.712,-1.905; 5 2.712,-1.905; 6 2.712,-0.635; 7 2.712,0.635; 8 2.712,1.905
DIL16 = drill 0.813 long: 1 -8.89,-3.81; 2 -6.35,-3.81; 3 -3.81,-3.81; 4 -1.27,-3.81; 5 1.27,-3.81; 6 3.81,-3.81; 7 6.35,-3.81; 8 8.89,-3.81; 9 8.89,3.81; 10 6.35,3.81; 11 3.81,3.81; 12 1.27,3.81; 13 -1.27,3.81; 14 -3.81,3.81; 15 -6.35,3.81; 16 -8.89,3.81
EESX1103 = drill 0.74 pad 1.269: 1 0,0; 2 0,2.5; 3 -4,2.5; 4 -4,0
SOP65P640X120-16N = smd 1.475 x 0.45: 1 -2.938,2.275; 2 -2.938,1.625; 3 -2.938,0.975; 4 -2.938,0.325; 5 -2.938,-0.325; 6 -2.938,-0.975; 7 -2.938,-1.625; 8 -2.938,-2.275; 9 2.938,-2.275; 10 2.938,-1.625; 11 2.938,-0.975; 12 2.938,-0.325; 13 2.938,0.325; 14 2.938,0.975; 15 2.938,1.625; 16 2.938,2.275
TO254P470X1028X1955-3P = drill 1.29 pad 1.935 square: 1 0,0 | drill 1.29 pad 1.935: 2 2.54,0; 3 5.08,0
TO255P460X1020X2008-3P = drill 1.32 pad 1.98 square: 1 0,0 | drill 1.32 pad 1.98: 2 2.55,0; 3 5.1,0
DIP794W53P254L1930H508Q14N = drill 0.73 pad 1.13 square: 1 -3.97,7.62 | drill 0.73 pad 1.13: 2 -3.97,5.08; 3 -3.97,2.54; 4 -3.97,0; 5 -3.97,-2.54; 6 -3.97,-5.08; 7 -3.97,-7.62; 8 3.97,-7.62; 9 3.97,-5.08; 10 3.97,-2.54; 11 3.97,0; 12 3.97,2.54; 13 3.97,5.08; 14 3.97,7.62
L3216C = smd 1.2 x 1.6: 1 -1.5,0; 2 1.5,0
TO254P470X1016X2019-3P = drill 1.37 pad 2.055 square: 1 0,0 | drill 1.37 pad 2.055: 2 2.535,0; 3 5.07,0
M0805 = smd 1.3 x 1.6: 1 -0.95,0; 2 0.95,0
R0805 = smd 1.3 x 1.5: 1 -0.95,0; 2 0.95,0
EG1218 = drill 0.9 pad 1.676: O -2.54,0; P 0,0; S 2.54,0
D8 = smd 1.981 x 0.559: 1 -2.464,1.905; 2 -2.464,0.635; 3 -2.464,-0.635; 4 -2.464,-1.905; 5 2.464,-1.905; 6 2.464,-0.635; 7 2.464,0.635; 8 2.464,1.905
AK300/2 = drill 1.321 long: 1 -2.515,0; 2 2.489,0
AK300/4 = drill 1.321 long: 1 -7.493,0; 2 -2.515,0; 3 2.515,0; 4 7.493,0
AK300/3 = drill 1.321 long: 1 -5.004,0; 2 0,0; 3 5.004,0

### Placement (x,y rotation side)
ARDPROMINI1  64.25,72.27 0 top
C1  104.76,50.33 270 top
C2  87.71,46.92 270 top
C3  111.93,24.93 0 top
C4  115.93,48.5 270 top
C5  82.07,32.93 0 top
C6  82.64,22.93 0 top
C7  57.22,35.06 0 top
C8  95.6,33.06 0 top
C9  58.42,16.89 0 top
C10  30.72,32.91 180 top
C11  45.15,21.91 180 top
C12  45.91,42.71 90 top
D1  44.49,55.07 180 top
IC  105.65,38.58 180 top
IC1  67.22,30.11 0 top
IC2  96.07,51.09 90 top
IC3  119.2,86.13 270 top
IC4  140.5,56.82 0 top
IC5  140.07,66.82 0 top
IC6  140.64,78.82 0 top
IC7  141.21,90.82 0 top
IC8  98.78,62.82 0 top
IC9  99.35,74.82 0 top
IC10  99.49,88.44 0 top
IC11  100.06,99.44 0 top
IC12  35.24,103.62 90 top
IC13  113.25,60.84 0 top
IC14  130.84,42.56 90 top
IC15  33.63,76.16 0 top
IC16  51.2,75.16 0 top
L1  50.07,31.75 90 top
L2  40.93,30.33 270 top
Q1  12.74,139.11 0 top
Q2  29.77,139.11 0 top
Q3  46.8,139.11 0 top
Q4  63.83,139.11 0 top
Q5  80.86,139.11 0 top
Q6  97.89,139.11 0 top
Q7  115.41,139.46 0 top
Q8  132.44,139.46 0 top
Q9  16.54,104.47 90 top
Q10  23.5,118.46 0 top
Q11  39.53,118.46 0 top
Q12  56.56,118.46 0 top
Q14  73.59,118.46 0 top
Q15  90.62,118.46 0 top
Q16  108.41,118.81 0 top
Q17  63.56,58.19 180 top
Q18  73.53,67.19 180 top
Q19  81.5,58.19 180 top
Q20  10.47,85.19 180 top
Q21  10.44,74.19 180 top
Q22  10.41,64.19 180 top
Q23  10.38,53.19 180 top
Q24  10.59,42.84 180 top
Q25  10.56,32.84 180 top
Q26  10.53,22.84 180 top
Q27  10.5,12.84 180 top
Q29  123.53,121.16 0 top
R1  37.04,38.41 0 top
R2  28.91,41.76 0 top
R3  32.94,21.06 0 top
R9  24.41,131.94 180 top
R11  58.76,131.94 180 top
R13  93.11,131.94 180 top
R15  123.46,132.94 180 top
R17  56.94,42.41 0 top
R18  113.59,35.41 0 top
R19  23.59,103.24 90 top
R20  25.31,112.59 180 top
R21  41.11,112.59 180 top
R22  57.66,112.59 180 top
R23  75.01,112.59 180 top
R24  92.36,112.59 180 top
R25  109.71,112.59 180 top
R26  126.46,112.59 180 top
R27  71.24,17.83 90 top
R29  102.24,20.49 90 top
R30  80.86,40.24 180 top
R31  87.76,100.21 270 top
R32  66.76,42.56 270 top
R34  88.76,76.91 270 top
R36  146.76,92.26 270 top
R37  88.76,64.61 270 top
R40  87.76,89.96 270 top
R41  146.76,68.31 270 top
R42  146.76,80.66 270 top
R44  146.76,58.01 270 top
RB  81.75,65.76 0 top
RL1  59.51,49.59 180 top
RL2  89.41,39.86 270 top
RL3  78.41,46.21 270 top
RMS_C1  129.29,68.82 90 top
RMS_C2  129.29,79.66 90 top
RMS_C3  129.29,90.5 90 top
RMS_C4  129.29,100.34 90 top
RMS_C5  109.82,98.29 180 top
RMS_C6  109.98,91.29 180 top
RMS_C7  110.14,82.29 180 top
RMS_C8  110.3,74.29 180 top
RSA1  20.06,84.02 270 top
RSA2  20.06,73.64 270 top
RSA3  20.06,63.26 270 top
RSA4  20.06,52.88 270 top
RSA5  20.06,42.5 270 top
RSA6  20.06,32.12 270 top
RSA7  20.06,22.74 270 top
RSA8  20.06,12.36 270 top
RU0  121.56,27.59 180 top
RU1  124.29,35.06 0 top
RU2  131.09,27.41 0 top
RU3  129.74,20.41 0 top
RUR  121.39,20.41 0 top
S1  95.18,21.95 90 top
U1  35.38,49.34 180 top
X1  7.45,130.06 270 top
X2  35.96,7.45 0 top
X3  7.45,118.49 270 top
X4  91.08,7.45 0 top
X5  143.04,130.95 90 top
X6  143,45 90 top
X7  143.04,119.52 90 top
X9  79.09,6.96 0 top
X10  143.04,106.66 90 top
X11  105.91,7.45 0 top
X13  120.8,6.96 0 top
X14  143.04,33.37 90 top
X15  143.04,20.94 90 top
X16  132.51,6.96 0 top

### Tracks (layer width: path | path; a pad name or v marks a point on that pad's centre or on a via)
+5V  (via drill 0.35)
  Top 0.254: IC3.5 115.42,84.94 115.42,85.34 121.31,91.24 121.31,93.27 122.94,94.89 IC3.16 | 139.6,89.81 138.18,89.81 137.36,90.63 IC7.4 | 139.6,89.81 141.63,89.81 143.05,91.24 146.71,91.24 R36.2 | 139.6,79.86 137.77,79.86 136.75,78.84 IC6.4 | 139.6,79.86 146.71,79.86 R42.2 | 139.6,79.86 139.6,89.81 | R41.2 146.91,67.26 147.93,66.24 147.93,58.12 146.91,57.1 R44.2 146.71,56.9 142.04,56.9 141.02,55.88 137.36,55.88 136.55,56.69 IC4.4 | v120.7,31.5 120.7,27.64 RU0.2 | R31.2 87.78,99.36 95.91,99.36 IC11.4 | 91.24,111.56 91.24,106.48 86.56,101.8 86.56,100.38 87.58,99.36 R31.2 | 91.24,111.56 91.24,112.57 R24.2 | 91.24,111.56 94.08,111.56 95.1,112.57 108.71,112.57 R25.2 108.92,112.57 108.92,111.76 109.53,111.15 111.76,111.15 113.18,112.57 125.37,112.57 R26.2 | 26.01,106.48 32.92,106.48 IC12.16 32.92,106.68 32.92,107.29 38.2,112.57 40.03,112.57 R21.2 40.23,112.57 41.25,111.56 42.88,111.56 43.89,112.57 56.69,112.57 R22.2 56.9,112.57 57.51,111.96 57.51,111.76 57.71,111.56 73.97,111.56 | 26.01,106.48 23.77,104.24 R19.2 | 26.01,106.48 24.38,108.1 24.38,112.57 R20.2 | R34.2 88.8,75.79 94.49,75.79 95.3,74.98 IC9.4 | 97.54,52.83 95.71,51 95.71,50.8 94.28,49.38 93.47,49.38 IC2.8 | 97.54,52.83 98.55,52.83 IC2.4 | 97.54,52.83 94.89,55.47 94.89,62.79 IC8.4 94.69,62.99 94.08,63.6 88.8,63.6 R37.2 88.59,63.8 87.58,64.82 87.58,66.24 88.59,67.26 88.59,75.79 R34.2 | R3.1 32.11,20.93 33.12,19.91 34.75,19.91 34.95,20.12 34.95,29.87 32.11,32.72 C10.+ | 32.31,49.78 32.72,49.78 U1.6 32.31,49.78 | 32.31,49.78 31.5,48.97 v31.5,42.47 | 46.33,81.28 43.89,83.72 37.8,83.72 IC15.14 | 46.33,81.28 53.65,81.28 55.07,82.7 IC16.14
  Top 0.254: 73.97,111.56 73.97,106.07 71.93,104.04 ARDPROMINI1.VCC1 | 73.97,111.56 73.97,112.57 R23.2 | R40.2 87.78,89 94.89,89 95.3,88.59 IC10.4 | 83.11,93.67 80.87,93.67 ARDPROMINI1.VCC2 | 83.11,93.67 87.58,89.2 R40.2 | 32.31,49.78 31.5,50.6 31.5,59.94 46.33,74.78 46.33,81.28 | R34.2 88.59,76 87.58,77.01 87.58,89 R40.2 | 83.11,93.67 87.58,98.15 87.58,99.16 R31.2
  Bottom 0.254: IC3.16 123.14,94.89 133.1,94.89 137.16,90.83 IC7.4 | v120.7,31.5 120.7,41.05 129.44,49.78 | 129.44,49.78 136.35,56.69 IC4.4 136.35,56.9 135.53,57.71 135.53,59.74 135.94,60.15 135.94,66.65 IC5.4 136.14,66.85 137.16,67.87 137.16,69.7 136.75,70.1 136.75,78.64 IC6.4 | 129.44,49.78 118.47,60.76 IC13.3 | v31.5,42.47 31.5,33.33 31.9,32.92 C10.+ | 73.97,100.58 80.67,93.88 ARDPROMINI1.VCC2 | 73.97,100.58 71.93,102.62 71.93,103.83 ARDPROMINI1.VCC1 | 73.97,100.58 66.04,92.66 65.02,92.66 55.27,82.91 IC16.14 | IC3.5 115.21,84.94 98.96,84.94 95.5,88.39 IC10.4
+12V  (via drill 0.35)
  Top 0.254: R9.2 23.37,131.88 18.29,131.88 7.52,121.11 X3.1 | R11.2 57.71,131.88 33.12,131.88 v22.35,121.11 22.35,119.89 22.15,119.69 22.15,103.83 22.76,103.23 24.59,103.23 24.79,103.02 24.79,87.78 20.12,83.11 RSA1.2 20.12,82.91 21.13,81.89 21.13,73.76 20.12,72.75 RSA2.2 20.12,72.54 21.13,71.53 21.13,63.4 20.12,62.38 RSA3.2 20.12,62.18 21.13,61.16 21.13,55.07 | 21.13,19.51 21.13,20.73 20.12,21.74 RSA7.2 20.12,21.95 v21.54,23.37 | 21.13,19.51 21.13,12.39 20.93,12.19 20.73,12.19 20.12,11.58 RSA8.2 | 20.52,31.7 21.13,32.31 21.13,40.44 20.12,41.45 RSA5.2 19.91,41.45 12.6,41.45 12.19,41.05 5.28,41.05 3.86,42.47 3.86,53.65 5.28,55.07 21.13,55.07 | 20.52,31.7 20.12,31.29 RSA6.2 20.52,31.7 | 20.52,31.7 v21.54,30.68 | 21.13,55.07 21.13,53.03 20.12,52.02 RSA4.2 | 122.12,122.53 122.12,132.69 122.33,132.89 R15.2 | 122.12,122.53 122.12,122.12 111.56,111.56 109.73,111.56 109.73,113.59 92.25,131.06 92.25,131.88 R13.2 | 122.12,122.53 129.24,122.53 134.72,117.04 142.85,117.04 X7.1 | v126.39,47.75 130.66,47.75 IC14.3 | 104.44,37.19 104.85,36.78 104.85,36.17 IC.6 | 104.44,37.19 102.82,38.81 89.61,38.81 RL2.2 89.41,38.81 v81.69,38.81 | 59.74,48.36 63.6,44.5 71.93,44.5 | 59.74,48.36 59.33,48.77 59.33,48.97 58.73,49.58 RL1.2 | 71.93,44.5 76.61,44.5 77.22,43.89 87.58,43.89 88.8,45.11 88.8,46.74 88.59,46.94 80.06,46.94 78.44,45.31 RL3.2 | v71.93,32.31 70.51,30.89 70.1,30.89 IC1.7 | 71.93,44.5 v71.93,43.48 | 104.44,37.19 v105.05,37.8 | 21.13,19.51 34.95,19.51 39.42,23.98 39.42,32.31 40.23,33.12 45.31,33.12 49.17,29.26 51,29.26 51.21,29.46 51.21,31.09 49.99,32.31 49.17,32.31 48.97,32.51 48.97,37.59 59.74,48.36
  Bottom 0.254: 9.75,121.11 7.52,121.11 X3.1 | 9.75,121.11 v22.35,121.11 | 9.75,121.11 9.75,128.22 7.52,130.45 7.52,132.49 X1.1 | v21.54,30.68 v21.54,23.37 | X5.1 142.85,128.42 142.85,124.77 140.61,122.53 140.61,119.28 142.85,117.04 X7.1 142.85,116.84 140.61,114.61 140.61,108.71 142.85,106.48 142.85,104.24 X10.1 142.85,104.04 142.85,86.16 136.55,79.86 132.28,79.86 113.39,60.96 IC13.1 113.39,60.76 120.7,53.44 | v126.39,47.75 120.7,53.44 | v71.93,43.48 71.93,38.81 | 71.93,38.81 v71.93,32.31 | 71.93,38.81 v81.69,38.81 | v105.05,37.8 120.7,53.44
+12V1
  Top 0.254: IC14.2 130.86,44.91 140.61,44.91 142.85,42.67 X6.1
-12V
  Top 0.254: 43.89,28.25 41.45,28.25 41.05,28.65 L2.2 | 43.89,28.25 64.41,28.25 IC1.4 | 43.89,28.25 43.89,21.95 C11.-
COM  (via drill 0.35)
  Top 0.254: v34.75,99.36 34.34,99.77 34.34,100.58 IC12.3 | v36.37,97.94 36.37,91.85 46.53,81.69 51.61,81.69 59.94,90.02 66.04,90.02 66.85,89.2 66.85,87.58 65.63,86.36 ARDPROMINI1.D4
  Bottom 0.254: v34.75,99.36 36.17,97.94 v36.37,97.94
EOUT
  Bottom 0.254: IC3.15 123.14,92.46 123.14,91.85 124.77,90.22 124.77,89.61 123.55,88.39 121.11,88.39 116.03,83.31 82.91,83.31 80.87,81.28 ARDPROMINI1.D13
F0
  Top 0.254: IC12.13 34.95,106.48 34.95,104.65 29.67,99.36 29.67,83.92 IC15.1
F0A
  Top 0.254: 16.66,85.14 13.01,85.14 11.58,86.56 9.35,86.56 8.13,85.34 Q20.2 | 16.66,85.14 19.91,85.14 RSA1.1 | 16.66,85.14 16.66,104.44 Q9.1 16.46,104.65 15.85,104.65 5.08,115.42 5.08,133.1 10.97,138.99 12.6,138.99 Q1.1
F1
  Top 0.254: IC12.14 34.14,106.48 34.14,104.44 28.65,98.96 28.65,79.65 29.46,78.84 IC15.3
F1A
  Top 0.254: RSA2.1 19.91,74.78 12.39,74.78 11.58,75.59 9.14,75.59 7.92,74.37 Q21.2
  Bottom 0.254: Q2.1 29.67,138.99 23.57,132.89 23.57,118.47 Q10.1 23.37,118.26 4.06,98.96 4.06,84.53 7.72,80.87 7.72,74.37 Q21.2
F2
  Top 0.254: IC12.15 33.53,106.48 33.53,105.66 32.72,104.85 29.06,104.85 26.62,102.41 26.62,76.61 29.46,73.76 IC15.5
F2A
  Top 0.254: RSA3.1 19.91,64.01 12.8,64.01 11.58,62.79 9.14,62.79 7.92,64.01 Q22.2
  Bottom 0.254: Q3.1 46.74,138.99 39.62,131.88 39.62,118.47 Q11.1 39.42,118.26 39.42,110.13 33.93,104.65 33.93,76.61 29.87,72.54 16.26,72.54 7.92,64.21 Q22.2
F3
  Top 0.254: IC12.12 35.56,106.48 35.56,104.65 32.31,101.4 32.31,80.06 37.8,74.57 38,74.57 38.61,73.97 38.61,71.93 37.8,71.12 IC15.9
F3A
  Top 0.254: RSA4.1 19.91,53.85 12.19,53.85 11.38,54.66 9.35,54.66 7.92,53.24 Q23.2
  Bottom 0.254: Q4.1 63.8,138.99 56.69,131.88 56.69,118.47 Q12.1 56.49,118.26 56.49,117.04 36.58,97.13 36.58,74.17 29.87,67.46 22.15,67.46 7.92,53.24 Q23.2
F4
  Top 0.254: IC12.1 32.92,100.58 32.92,80.87 37.59,76.2 IC15.11
F4A  (via drill 0.35)
  Top 0.254: Q24.2 8.13,42.67 9.35,41.45 11.99,41.45 13.82,43.28 19.91,43.28 RSA5.1 20.12,43.48 20.12,49.58 v43.28,72.75
  Bottom 0.254: Q5.1 80.67,138.99 73.76,132.08 73.76,118.47 Q14.1 73.56,118.26 66.24,118.26 43.28,95.3 v43.28,72.75
F5
  Top 0.254: IC12.5 35.56,100.58 35.56,85.95 34.54,84.94 34.54,84.33 37.59,81.28 IC15.13
F5A
  Top 0.254: RSA6.1 19.91,32.92 13.21,32.92 11.79,31.5 9.35,31.5 8.13,32.72 Q25.2 7.92,32.92 7.92,37.8 3.45,42.27 3.45,132.28 12.19,141.02 85.95,141.02 92.66,134.31 | 92.66,134.31 97.33,138.99 97.74,138.99 Q6.1 | 92.66,134.31 90.63,132.28 Q15.1
F6
  Top 0.254: IC12.2 33.73,100.79 33.73,101.6 34.54,102.41 49.17,102.41 50.6,100.99 50.6,86.16 47.35,82.91 IC16.1
F6A
  Top 0.254: RSA7.1 19.91,23.77 12.19,23.77 11.79,24.18 9.35,24.18 8.13,22.96 Q26.2 | Q16.1 108.51,118.87 108.51,132.69 115.21,139.4 Q7.1
  Bottom 0.254: Q26.2 7.92,22.96 7.92,28.45 3.86,32.51 3.86,64.62 14.43,75.18 30.07,75.18 32.72,77.83 32.72,127.61 46.13,141.02 113.79,141.02 115.21,139.6 Q7.1
F7  (via drill 0.35)
  Top 0.254: v42.06,101.6 41.86,101.8 35.15,101.8 34.95,101.6 34.95,100.79 IC12.4
  Bottom 0.254: v42.06,101.6 42.06,72.95 43.08,71.93 43.48,71.93 45.92,74.37 45.92,80.26 46.94,81.28 47.55,81.28 48.16,80.67 48.16,78.64 47.35,77.83 IC16.3
F7A  (via drill 0.35)
  Top 0.254: RSA8.1 19.91,13.41 12.39,13.41 11.58,14.22 9.35,14.22 8.13,13.01 Q27.2 | v96.93,48.77 v91.24,43.08
  Bottom 0.254: 125.58,119.69 124.16,121.11 123.55,121.11 Q29.1 | 125.58,119.69 131.47,119.69 143.87,132.08 144.47,132.08 145.49,133.1 145.49,133.91 141.43,137.97 133.91,137.97 132.49,139.4 Q8.1 | v91.24,43.08 52.43,4.27 16.46,4.27 9.14,11.58 9.14,11.79 8.13,12.8 Q27.2 | v96.93,48.77 124.77,76.61 124.77,80.06 123.55,81.28 121.92,81.28 121.31,81.89 121.31,85.34 122.33,86.36 124.16,86.36 125.17,87.38 125.17,92.46 123.75,93.88 122.12,93.88 121.31,94.69 121.31,115.42 125.58,119.69
FB0
  Bottom 0.254: IC15.2 29.46,81.28 14.43,81.28 10.57,85.14 Q20.1
FB1
  Bottom 0.254: IC15.4 29.46,76 12.19,76 10.57,74.37 Q21.1
FB2
  Bottom 0.254: IC15.6 29.46,70.92 17.27,70.92 10.57,64.21 Q22.1
FB3
  Bottom 0.254: IC15.8 37.59,68.48 32.11,68.48 16.87,53.24 10.57,53.24 Q23.1
FB4
  Top 0.254: IC15.10 37.59,73.56 37.59,72.54 21.54,56.49 21.54,51.61 12.8,42.88 10.77,42.88 Q24.1
FB5
  Bottom 0.254: IC15.12 37.8,78.64 37.8,77.42 38.61,76.61 38.61,60.96 10.57,32.92 Q25.1
FB6  (via drill 0.35)
  Top 0.254: v12.8,22.96 10.57,22.96 Q26.1
  Bottom 0.254: v12.8,22.96 12.8,26.62 39.42,53.24 39.42,63.6 46.94,71.12 47.14,71.12 48.16,72.14 48.16,75.59 47.55,76.2 47.35,76.2 46.33,77.22 46.33,78.23 47.14,79.05 47.14,80.06 IC16.2
FB7
  Bottom 0.254: IC16.4 47.14,74.98 47.14,73.97 39.01,65.84 39.01,55.68 11.99,28.65 11.99,14.43 10.57,13.01 Q27.1
FD
  Top 0.254: Q10.3 28.65,118.47 30.07,119.89 42.67,119.89 44.09,118.47 44.5,118.47 Q11.3 44.7,118.47 54.05,118.47 55.47,119.89 60.15,119.89 61.57,118.47 Q12.3 61.77,118.47 71.12,118.47 72.54,119.89 77.22,119.89 78.64,118.47 Q14.3 78.84,118.26 82.09,115.01 82.09,98.55 81.28,97.74 80.26,97.74 79.45,96.93 79.45,73.15 81.89,70.71 81.89,66.85 | 81.89,66.85 80.87,65.84 RB.1 | 81.89,66.85 83.52,66.85 94.49,55.88 94.49,54.46 95.91,53.03 95.91,52.22 94.28,50.6 93.47,50.6 IC2.7
  Bottom 0.254: Q9.3 16.66,109.73 19.91,109.73 28.45,118.26 Q10.3 | Q29.3 128.42,121.31 127.2,122.53 122.33,122.53 118.67,118.87 113.59,118.87 Q16.3 113.39,118.67 112.78,118.67 111.56,117.45 96.52,117.45 95.71,118.26 Q15.3 95.5,118.26 94.89,118.26 93.67,117.04 80.06,117.04 78.84,118.26 Q14.3
GND  (via drill 0.35)
  Top 0.254: Q27.3 5.49,13.01 5.49,22.76 Q26.3 5.49,22.96 5.49,29.87 | Q23.3 5.49,53.03 5.49,42.88 Q24.3 | 5.49,29.87 5.49,32.72 Q25.3 | Q22.3 5.49,64.21 5.49,74.17 Q21.3 5.49,74.37 5.49,85.14 Q20.3 | IC16.7 47.35,67.46 49.17,67.46 58.32,58.32 Q17.3 58.52,58.32 59.13,58.32 67.06,66.24 68.48,66.24 | v68.07,42.67 67.87,42.67 66.85,41.66 R32.2 | C2.2 87.58,45.92 80.87,45.92 79.25,44.3 77.42,44.3 76.61,45.11 76.61,58.12 Q19.3 76.4,58.32 68.48,66.24 | 68.48,66.24 68.48,67.06 Q18.3 68.48,66.24 | 28.04,34.14 28.04,41.66 R2.1 | 28.04,34.14 29.26,32.92 C10.- | 53.65,17.88 54.46,17.07 C9.+ | 53.65,17.88 49.78,21.74 46.53,21.74 C11.+ | 53.65,17.88 53.65,17.68 43.48,7.52 X2.4 | 53.65,17.88 C9.+ | L1.2 50.19,33.12 53.65,29.67 64.41,29.67 IC1.3 64.62,29.67 65.63,28.65 65.63,22.35 68.07,19.91 | 68.07,19.91 70.31,17.68 70.51,17.68 71.12,17.07 R27.1 71.32,16.87 71.32,9.35 76,4.67 77.22,4.67 79.45,6.91 81.48,6.91 X9.2 81.69,6.91 83.52,5.08 101.4,5.08 103.63,7.32 105.87,7.32 X11.2 106.07,7.32 108.1,7.32 110.34,5.08 111.35,5.08 120.29,14.02 120.29,20.32 RUR.1 120.29,20.52 120.29,26.01 119.48,26.82 119.48,31.29 121.51,33.33 | 68.07,19.91 62.99,14.83 61.57,14.83 59.54,16.87 54.66,16.87 C9.+ | 5.49,29.87 23.77,29.87 28.04,34.14 | Q7.3 120.5,139.6 130.05,139.6 131.27,140.82 136.14,140.82 137.36,139.6 Q8.3 137.57,139.4 137.57,130.45 145.49,122.53 145.49,111.76 143.05,109.32 X10.2 142.85,109.12 132.89,99.16 132.69,99.16 | Q1.3 17.88,139.19 27.23,139.19 28.65,140.61 33.33,140.61 34.75,139.19 Q2.3 34.95,139.19 44.3,139.19 45.72,140.61 50.39,140.61 51.82,139.19 Q3.3 52.02,139.19 61.37,139.19 62.79,140.61 67.46,140.61 68.89,139.19 Q4.3 69.09,138.99 70.31,137.77 83.92,137.77 85.14,138.99 85.75,138.99 Q5.3
  Top 0.254: 109.32,74.37 109.32,82.09 RMS_C7.2 | 111.96,73.15 115.21,76.4 115.21,77.22 IC3.8 115.42,77.42 116.03,77.42 121.92,83.31 129.44,83.31 | 111.96,73.15 110.54,73.15 109.53,74.17 RMS_C8.2 109.32,74.37 | 99.77,74.37 99.77,64.82 98.96,64.01 98.96,62.99 IC8.1 | 99.77,74.37 99.36,74.78 IC9.1 99.77,74.37 | 99.77,74.37 109.32,74.37 | 128.83,26.01 128.83,20.52 RU3.1 | 128.83,26.01 130.05,27.23 RU2.1 | 121.51,33.33 123.14,34.95 RU1.1 123.34,35.15 127.81,39.62 | 127.81,39.62 130.66,42.47 IC14.1 | 121.51,33.33 128.83,26.01 | 104.65,42.67 103.83,41.86 103.83,41.25 IC.4 | 104.65,42.67 105.46,42.67 106.27,41.86 106.27,41.25 IC.2 | 104.65,49.38 98.75,49.38 IC2.1 | 104.65,49.38 104.65,42.67 | 104.65,49.38 C1.2 104.85,49.38 107.09,51.61 115.82,51.61 | 115.82,51.61 127.81,39.62 | 115.82,51.61 C4.- 115.82,51.82 115.82,60.76 IC13.2 115.62,60.96 111.96,64.62 111.96,73.15 | 79.45,102.82 79.45,103.83 ARDPROMINI1.GRN | 79.45,102.82 79.45,100.99 80.67,99.77 80.67,98.96 ARDPROMINI1.GND2 | IC12.6 36.37,100.79 36.78,100.79 IC12.7 36.98,100.79 37.39,100.79 IC12.8 37.59,100.79 v49.78,100.79 | ARDPROMINI1.GND 66.85,104.04 69.29,104.04 ARDPROMINI1.GND1 69.49,103.83 70.51,102.82 79.45,102.82 | 138.99,67.87 136.14,67.87 134.31,69.7 129.44,69.7 RMS_C1.2 | 138.99,67.87 140,66.85 IC5.1 140,66.65 139.4,66.04 139.4,59.13 140.41,58.12 140.41,56.9 IC4.1 137.79,56.82 136.88,57.73 136.12,57.73 135.59,57.2 135.59,56.44 136.55,55.47 138.53,55.47 143,51 X6.2 | 140.61,77.83 140.61,71.32 138.99,69.7 138.99,67.87 | 140.61,77.83 140.61,78.64 IC6.1 | RMS_C5.2 108.92,98.15 108.92,91.44 RMS_C6.2 108.92,91.24 106.27,88.59 99.57,88.59 IC10.1
  Top 0.254: IC11.1 100.18,99.36 107.7,99.36 108.71,98.35 RMS_C5.2 | 129.44,83.31 129.44,87.78 130.45,88.8 130.45,90.42 | 129.44,83.31 129.44,80.67 RMS_C2.2 129.44,80.47 132.08,77.83 140.61,77.83 | 130.45,90.42 129.44,91.44 RMS_C3.2 | 138.58,93.27 141.02,90.83 IC7.1 | 138.58,93.27 132.69,99.16 | 132.69,99.16 130.66,101.19 129.44,101.19 RMS_C4.2 129.24,101.19 111.76,101.19 108.92,98.35 RMS_C5.2 | 130.45,90.42 135.33,90.42 137.16,92.25 137.57,92.25 138.58,93.27
  Bottom 0.254: Q25.3 5.49,32.92 5.49,42.67 Q24.3 | 6.71,62.79 11.58,62.79 17.27,68.48 29.46,68.48 IC15.7 | 6.71,62.79 5.49,64.01 Q22.3 | 6.71,62.79 5.49,61.57 5.49,53.24 Q23.3 | v68.07,42.67 68.07,49.78 76.4,58.12 Q19.3 | 31.9,31.29 40.03,23.16 45.11,23.16 46.33,21.95 C11.+ | 31.9,31.29 30.48,32.72 29.46,32.72 C10.- | 31.9,31.29 33.12,32.51 33.12,32.92 58.32,58.12 Q17.3 | Q5.3 85.95,139.19 87.38,140.61 100.79,140.61 102.21,139.19 102.82,139.19 Q6.3 103.02,138.99 104.04,137.97 118.47,137.97 119.89,139.4 120.29,139.4 Q7.3 | 62.99,100.79 v49.78,100.79 | 62.99,100.79 66.04,103.83 66.65,103.83 ARDPROMINI1.GND | 62.99,100.79 62.99,97.13 65.43,94.69 65.43,93.88 ARDPROMINI1.GND3 | ARDPROMINI1.GRN 79.65,103.83 95.71,103.83 99.97,99.57 IC11.1
  pour Bottom: -2,151 -2,-1 1,-4 148,-4 157,5 157,150 146,161 8,161
  pour Top: 0,157 -4,153 -4,-5 149,-5 158,4 158,152 146,164 7,164
GS
  Bottom 0.254: IC3.14 122.94,89.81 119.89,89.81 116.43,86.36 98.96,86.36 95.3,90.02 80.06,90.02 78.84,91.24 65.63,91.24 ARDPROMINI1.D2
LEDINB
  Top 0.254: IC16.10 55.27,72.54 64.82,72.54 68.28,69.09 74.17,69.09 80.06,63.2 80.06,59.74 81.48,58.32 Q19.1
LEDING
  Top 0.254: IC16.8 55.27,67.67 67.06,67.67 68.07,68.68 71.93,68.68 73.36,67.26 Q18.1
LEDINR
  Bottom 0.254: IC16.6 47.35,69.9 51.41,69.9 62.99,58.32 63.4,58.32 Q17.1
LEDPB
  Top 0.254: IC16.11 55.27,75.18 59.54,75.18 65.43,81.08 ARDPROMINI1.D6
LEDPG
  Bottom 0.254: IC16.9 55.27,70.1 55.27,71.32 64.21,80.26 64.21,82.3 65.43,83.52 ARDPROMINI1.D5
LEDPR
  Top 0.254: IC16.5 47.35,72.75 48.77,72.75 55.27,79.25 56.08,79.25 65.43,88.59 ARDPROMINI1.D3
LOB
  Top 0.254: RL3.1 78.44,47.35 78.44,57.71 78.84,58.12 Q19.2
  Bottom 0.254: X2.1 28.65,7.32 30.68,7.32 33.33,4.67 39.22,4.67 42.06,7.52 42.06,14.63 78.84,51.41 78.84,58.12 Q19.2
LOG  (via drill 0.35)
  Top 0.254: v89.61,42.47 89.61,40.84 RL2.1
  Bottom 0.254: v89.61,42.47 89.61,47.75 92.25,50.39 92.25,51 77.42,65.84 72.34,65.84 | 72.34,65.84 71.12,67.06 Q18.2 | 72.34,65.84 67.26,60.76 67.26,40.44 41.66,14.83 41.66,7.72 39.01,5.08 38,5.08 35.76,7.32 33.53,7.32 X2.2
LOR
  Top 0.254: RL1.1 60.55,49.78 60.55,57.71 60.96,58.12 Q17.2
  Bottom 0.254: X2.3 38.61,7.52 38.61,12.39 47.95,21.74 47.95,45.11 60.96,58.12 Q17.2
MS1
  Top 0.254: IC4.3 136.35,59.33 129.44,66.24 129.44,67.87 RMS_C1.1 129.24,67.87 128.22,68.89 128.22,74.17 123.14,79.25 123.14,79.65 IC3.10
MS2
  Top 0.254: IC3.11 123.14,82.3 126.59,78.84 129.24,78.84 RMS_C2.1 129.44,78.64 135.94,72.14 135.94,69.49 IC5.3
MS3
  Top 0.254: RMS_C3.1 129.24,89.41 127.61,89.41 123.14,84.94 IC3.12
  Bottom 0.254: IC6.3 136.55,81.48 126.39,81.48 123.14,84.73 IC3.12
MS4
  Top 0.254: 133.1,97.54 137.16,93.47 IC7.3 | 133.1,97.54 131.27,99.36 129.44,99.36 RMS_C4.1 | 133.1,97.54 123.14,87.58 IC3.13
MS5
  Top 0.254: RMS_C5.1 110.95,98.15 112.17,98.15 115.21,95.1 IC3.1 115.42,94.89 117.04,93.27 117.04,92.05 116.43,91.44 114.81,91.44 99.77,76.4 99.57,76.4 94.89,71.73 94.89,65.43 IC8.3
MS6
  Top 0.254: IC3.2 115.21,92.46 114.2,91.44 110.95,91.44 RMS_C6.1 110.95,91.24 97.13,77.42 95.5,77.42 IC9.3
MS7
  Top 0.254: RMS_C7.1 111.15,82.3 111.15,85.75 115.21,89.81 IC3.3
  Bottom 0.254: IC10.3 95.5,90.83 98.15,90.83 98.96,90.02 115.21,90.02 IC3.3
MS8
  Top 0.254: RMS_C8.1 111.35,74.37 111.35,80.67 113.59,82.91 113.59,85.75 115.21,87.38 IC3.4
  Bottom 0.254: IC11.3 96.11,101.8 106.88,91.03 116.43,91.03 117.04,90.42 117.04,89.2 115.42,87.58 IC3.4
N$1
  Top 0.254: Q2.2 32.31,138.99 25.4,132.08 R9.1 25.2,132.08 19.71,137.57 15.24,137.57 | 15.24,137.57 7.52,129.84 7.52,127.61 X1.2 | 15.24,137.57 15.24,138.99 Q1.2
N$3
  Top 0.254: Q4.2 66.24,138.99 59.74,132.49 59.74,132.08 R11.1 59.54,132.08 53.85,137.77 50.6,137.77 49.38,138.99 Q3.2 49.17,138.99 47.95,137.77 38,137.77 16.26,116.03 7.52,116.03 X3.2
N$4  (via drill 0.35)
  Top 0.254: U1.7 32.92,48.56 32.92,47.55 U1.8 32.92,47.35 v33.73,46.53 | R3.2 33.73,21.13 33.73,29.46 30.89,32.31 30.89,33.33 34.34,36.78 39.01,36.78 39.42,37.19 39.42,45.92 38,47.35 U1.1 37.8,47.35 v36.98,46.53
  Bottom 0.254: v36.98,46.53 v33.73,46.53
N$5
  Top 0.254: R13.1 94.08,132.08 94.08,132.69 100.38,138.99 Q6.2
  Bottom 0.254: X5.2 142.85,133.5 106.07,133.5 100.58,138.99 Q6.2 100.38,138.99 99.16,137.77 85.34,137.77 84.12,138.99 83.52,138.99 Q5.2
N$6
  Top 0.254: 43.48,37.39 39.83,41.05 39.83,47.14 38.41,48.56 38,48.56 U1.2 | 43.48,37.39 49.99,30.89 49.99,30.28 L1.1 | 43.48,37.39 48.16,42.06 48.16,55.07 D1.C
N$7
  Top 0.254: Q7.2 118.06,139.4 124.36,133.1 R15.1 124.56,132.89 135.13,132.89 | 135.13,132.89 135.13,139.4 Q8.2 | 135.13,132.89 135.13,132.28 142.85,124.56 142.85,122.12 X7.2
N$8
  Top 0.254: U1.3 38,49.78 38.61,49.78 44.7,43.69 44.7,42.47 45.72,41.45 C12.+
N$9
  Top 0.254: C2.1 87.78,47.95 92.66,52.83 93.27,52.83 IC2.5
N$10
  Top 0.254: R44.1 146.71,59.13 140.61,59.13 IC4.2
N$11  (via drill 0.35)
  Top 0.254: C1.1 104.65,51.21 99.97,51.21 99.36,50.6 98.75,50.6 IC2.2 98.55,50.6 v96.93,50.6 | 94.89,52.43 94.89,53.44 82.7,65.63 RB.2 | 94.89,52.43 94.28,51.82 93.47,51.82 IC2.6 | 94.89,52.43 v95.1,52.43
  Bottom 0.254: v95.1,52.43 v96.93,50.6
N$12
  Top 0.254: R19.1 23.57,102.41 21.13,102.41 16.66,106.88 Q9.2
N$13
  Top 0.254: R20.1 26.21,112.78 26.21,118.26 Q10.2
N$14
  Top 0.254: R21.1 42.06,112.78 42.06,118.26 Q11.2
N$15
  Top 0.254: R22.1 58.73,112.78 58.73,118.06 58.93,118.26 Q12.2
N$16
  Top 0.254: R23.1 76,112.78 76,118.26 Q14.2
N$17
  Top 0.254: R24.1 93.27,112.78 93.27,118.26 Q15.2
N$18
  Top 0.254: R25.1 110.74,112.78 110.74,118.67 Q16.2
N$19
  Top 0.254: R26.1 127.41,112.78 127.41,119.89 126.19,121.11 Q29.2
N$20
  Top 0.254: IC.7 106.48,36.17 106.48,39.42 106.88,39.83 106.88,42.47 109.53,45.11 115.82,45.11 C4.+
N$21
  Top 0.254: IC.5 103.63,35.97 88.19,35.97 85.34,33.12 C5.+ 85.34,32.92 85.75,32.51 85.75,22.96 C6.+
N$22
  Top 0.254: IC.8 107.7,35.97 107.7,25.81 108.51,24.99 C3.-
N$23
  Top 0.254: IC.3 105.05,41.05 105.05,38.81 105.87,38 105.87,37.39 105.66,37.19 105.66,12.6 110.74,7.52 X11.3
N$24
  Top 0.254: R27.2 71.32,18.9 71.32,25.6 78.64,32.92 C5.-
N$25
  Top 0.254: R18.1 112.57,35.56 112.57,36.17 107.7,41.05 IC.1
N$26
  Top 0.254: R18.2 114.61,35.36 114.61,25.4 115.01,24.99 C3.+
N$27
  Top 0.254: R29.2 102.21,21.54 95.71,21.54 95.3,21.95 S1.P
N$28
  Top 0.254: R17.1 56.08,42.27 56.08,35.15 C7.1 56.29,34.95 60.35,30.89 64.41,30.89 IC1.2 64.62,30.89 65.02,30.89 74.37,40.23 79.86,40.23 R30.2
N$29
  Top 0.254: C7.2 58.12,35.15 58.12,42.06 57.91,42.27 R17.2 57.91,42.47 58.93,43.48 66.65,43.48 R32.1 66.85,43.48 70.71,43.48 72.75,41.45 80.67,41.45 80.87,41.25 80.87,34.95 80.47,34.54 | 80.47,34.54 80.67,34.34 80.67,24.99 84.33,21.34 87.58,21.34 94.49,28.25 94.49,32.92 C8.1 | 80.47,34.54 75.39,34.54 70.51,29.67 70.1,29.67 IC1.6
N$30
  Top 0.254: RUR.2 122.33,20.32 122.33,10.97 118.47,7.11 X13.1
N$31
  Top 0.254: R37.1 88.8,65.43 93.27,65.43 94.49,64.21 97.74,64.21 98.75,65.23 IC8.2
N$32
  Top 0.254: R41.1 146.71,69.29 140.21,69.29 IC5.2
N$33
  Top 0.254: RU3.2 130.66,20.32 130.66,7.72 130.05,7.11 X16.1
N$34
  Top 0.254: RU2.2 132.08,27.23 134.11,27.23 142.85,18.49 X15.1
N$35
  Top 0.254: RU1.2 125.37,34.95 138.79,34.95 142.85,30.89 X14.1
N$36
  Top 0.254: R42.1 146.71,81.48 140.82,81.48 IC6.2
N$37
  Top 0.254: R36.1 146.71,93.27 141.22,93.27 IC7.2
N$38
  Top 0.254: 34.75,41.66 37.8,38.61 R1.2 | 34.75,41.66 29.87,41.66 R2.2 | 34.75,41.66 34.75,49.99 33.53,51.21 32.92,51.21 U1.5
N$39
  Top 0.254: R31.1 87.78,100.99 99.16,100.99 99.97,101.8 IC11.2
N$40
  Top 0.254: R40.1 87.78,90.83 94.28,90.83 95.1,90.02 98.55,90.02 99.36,90.83 IC10.2
N$41
  Top 0.254: R34.1 88.8,77.83 93.47,77.83 94.89,76.4 98.35,76.4 99.16,77.22 IC9.2
N$42  (via drill 0.35)
  Top 0.254: R1.1 36.17,38.41 36.98,37.59 36.98,37.39 37.19,37.19 38.81,37.19 39.01,37.39 39.01,43.08 35.97,46.13 35.97,49.78 37.39,51.21 37.8,51.21 U1.4 | 38.61,51.21 45.72,44.09 C12.- | 38.61,51.21 38,51.21 U1.4 | 38.61,51.21 40.64,53.24 40.64,55.07 D1.A | 38.61,51.21 U1.4 | C9.- 62.18,17.07 56.08,23.16 46.13,23.16 45.31,22.35 45.31,21.74 44.3,20.73 43.48,20.73 39.83,24.38 39.83,29.67 40.84,30.68 40.84,31.7 L2.1 41.05,31.9 41.45,32.31 v42.27,32.31
  Bottom 0.254: v42.27,32.31 42.27,39.42 45.72,42.88 45.72,43.89 C12.-
N$43
  Top 0.254: R29.1 102.21,19.51 102.21,8.74 100.99,7.52 X11.1
N$44
  Top 0.254: C8.2 96.52,32.92 96.52,25.81 95.3,24.59 S1.S
N$45
  Top 0.254: R30.1 81.89,40.44 86.56,40.44 96.11,49.99 96.11,50.8 96.93,51.61 98.55,51.61 IC2.3
Q0
  Bottom 0.254: IC3.9 122.94,77.22 117.45,77.22 113.79,73.56 80.87,73.56 ARDPROMINI1.D10
Q1
  Bottom 0.254: IC3.7 115.21,79.65 84.33,79.65 80.87,76.2 ARDPROMINI1.D11
Q2
  Bottom 0.254: IC3.6 115.21,82.5 106.27,82.5 105.87,82.91 85.14,82.91 80.87,78.64 ARDPROMINI1.D12
S_IN_TEST
  Top 0.254: S1.O 95.1,19.3 95.1,8.94 93.67,7.52 X4.2
S_OUT_TEST
  Top 0.254: 79.25,9.75 79.25,22.76 C6.- | 79.25,9.75 76.61,7.11 X9.1 | 79.25,9.75 81.69,9.75 83.92,7.52 88.39,7.52 X4.1
SO0
  Top 0.254: IC12.11 36.17,106.48 36.17,105.87 37.8,104.24 53.44,104.24 65.02,92.66 65.84,92.66 67.26,91.24 67.26,80.26 65.63,78.64 ARDPROMINI1.D7
SO1
  Top 0.254: IC12.10 36.98,106.68 36.98,107.49 37.19,107.7 55.07,107.7 65.02,97.74 65.84,97.74 68.07,95.5 68.07,78.64 65.63,76.2 ARDPROMINI1.D8
SO2
  Top 0.254: IC12.9 37.59,106.48 53.65,106.48 65.02,95.1 66.04,95.1 67.26,93.88 67.26,91.85 67.67,91.44 67.67,79.05 66.04,77.42 65.02,77.42 64.21,76.61 64.21,74.78 65.43,73.56 ARDPROMINI1.D9
UI1
  Top 0.254: RU0.1 122.53,27.43 122.53,22.15 123.34,21.34 123.34,7.11 X13.2
  Bottom 0.254: X14.2 142.85,35.76 140.61,33.53 140.61,30.48 142.85,28.25 142.85,23.57 X15.2 142.85,23.37 142.85,21.74 130.45,9.35 | ARDPROMINI1.A0 80.67,83.52 80.67,82.91 79.45,81.69 79.45,64.82 104.24,40.03 104.24,26.01 123.14,7.11 X13.2 123.34,7.11 125.58,9.35 130.45,9.35 | 130.45,9.35 132.69,7.11 134.93,7.11 X16.2

### Text on the board
tPlace: Team 3A - Magical Fountain